# EAGLE design Adafruit PyPortal Titano (EAGLE 9.5.1)

## Sheet 1 of 3
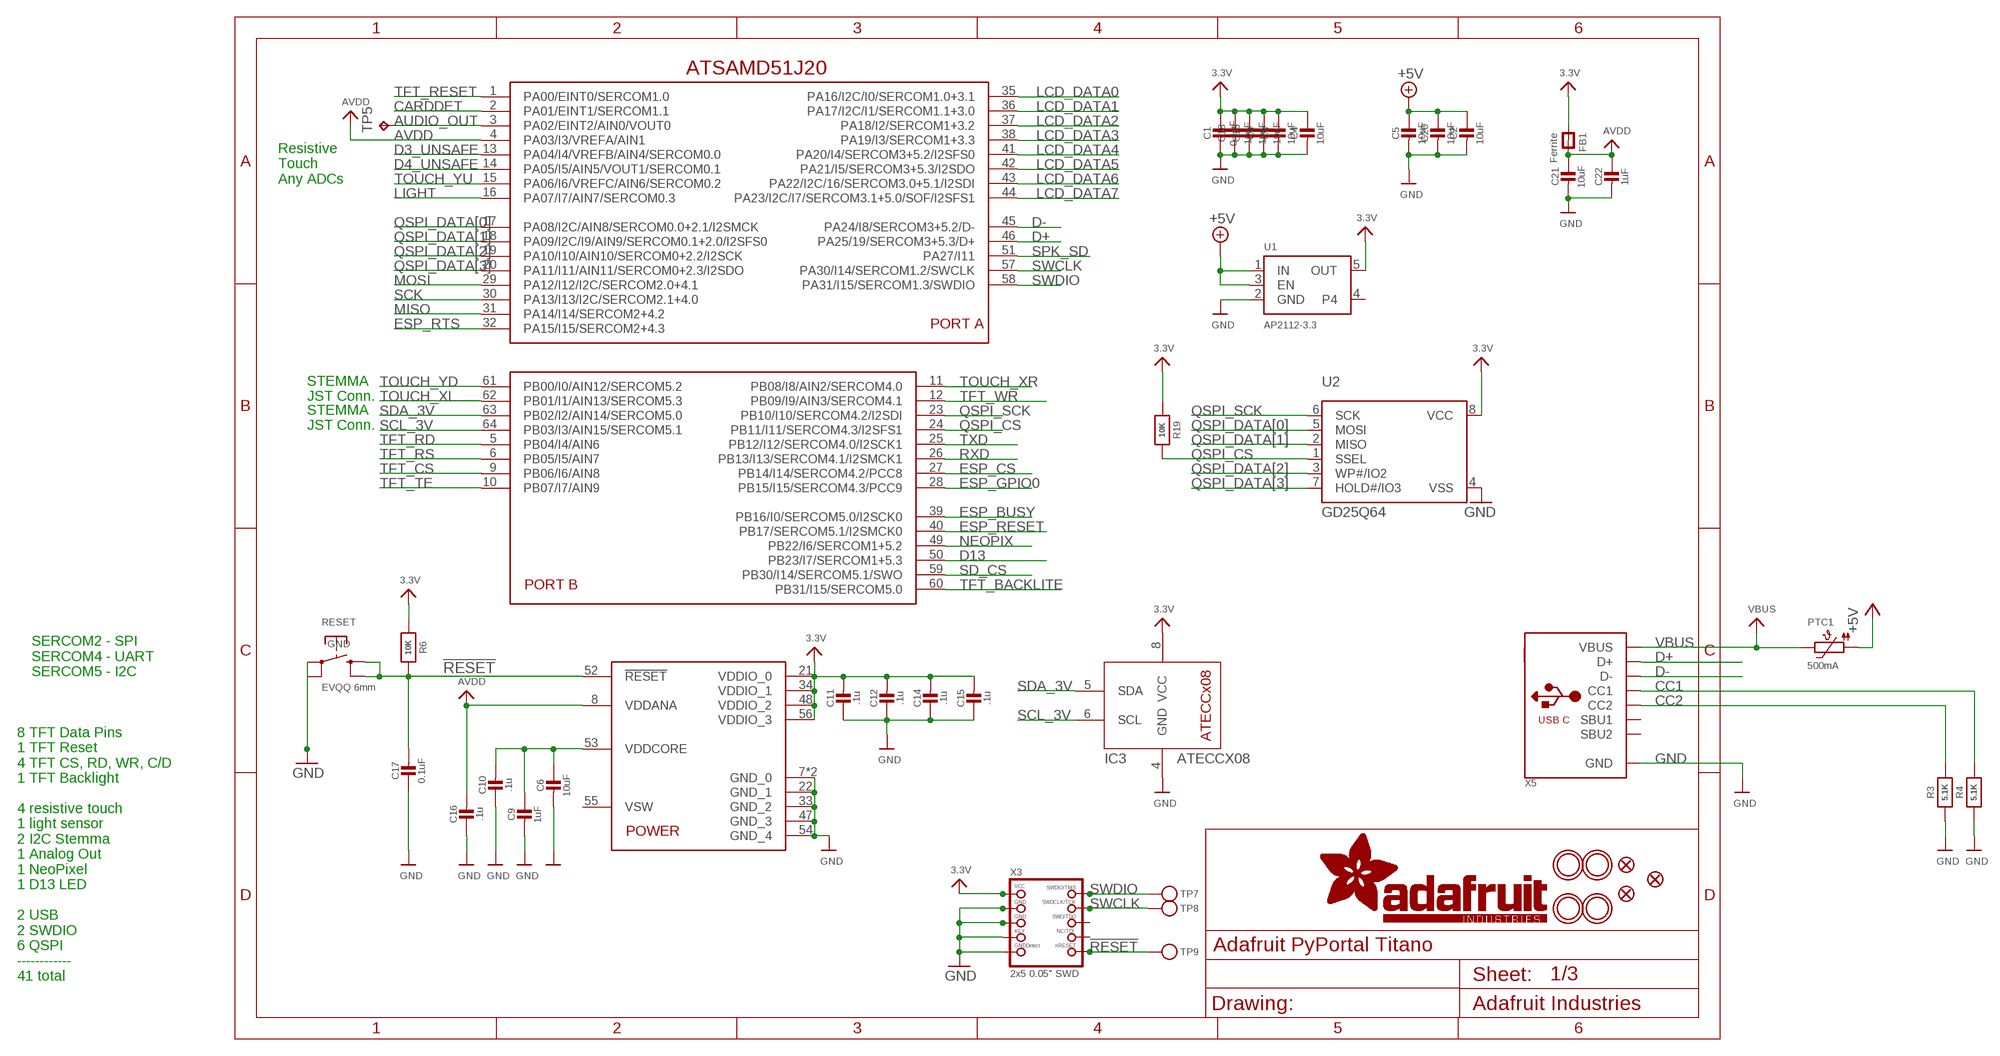
[diagram p0: schematic, sheet 1]

### Parts
C1  0.1uF  CAP_CERAMIC0603_NO  [0603-NO]
C2  10uF  CAP_CERAMIC0805-NOOUTLINE  [0805-NO]
C3  10uF  CAP_CERAMIC0805-NOOUTLINE  [0805-NO]
C4  10uF  CAP_CERAMIC0805-NOOUTLINE  [0805-NO]
C5  10uF  CAP_CERAMIC0805-NOOUTLINE  [0805-NO]
C6  10uF  CAP_CERAMIC0805-NOOUTLINE  [0805-NO]
C8  10uF  CAP_CERAMIC0805-NOOUTLINE  [0805-NO]
C9  1uF  CAP_CERAMIC0603_NO  [0603-NO]
C10  .1u  CAP_CERAMIC0603_NO  [0603-NO]
C11  .1u  CAP_CERAMIC0603_NO  [0603-NO]
C12  .1u  CAP_CERAMIC0603_NO  [0603-NO]
C13  10uF  CAP_CERAMIC0805-NOOUTLINE  [0805-NO]
C14  .1u  CAP_CERAMIC0603_NO  [0603-NO]
C15  .1u  CAP_CERAMIC0603_NO  [0603-NO]
C16  .1u  CAP_CERAMIC0603_NO  [0603-NO]
C17  0.1uF  CAP_CERAMIC0603_NO  [0603-NO]
C18  10uF  CAP_CERAMIC0805-NOOUTLINE  [0805-NO]
C20  10uF  CAP_CERAMIC0805-NOOUTLINE  [0805-NO]
C21  10uF  CAP_CERAMIC0805-NOOUTLINE  [0805-NO]
C22  1uF  CAP_CERAMIC0603_NO  [0603-NO]
FB1  Ferrite  FERRITE-0805NO  [0805-NO]
IC3  ATECCX08  [SOIC8_150MIL]
PTC1  500mA  PTC1206  [1206]
R3  5.1K  RESISTOR_0603_NOOUT  [0603-NO]
R4  5.1K  RESISTOR_0603_NOOUT  [0603-NO]
R6  10K  RESISTOR_0603_NOOUT  [0603-NO]
R19  10K  RESISTOR_0603_NOOUT  [0603-NO]
RESET  EVQQ 6mm  SWITCH_TACT_SMT_EVQQ2_SMALL  [EVQ-Q2_SMALLER]
TP5  TPTP15R  [TP15R]
TP7  TESTPOINTROUND1.5MM  [TESTPOINT_ROUND_1.5MM]
TP8  TESTPOINTROUND1.5MM  [TESTPOINT_ROUND_1.5MM]
TP9  TESTPOINTROUND1.5MM  [TESTPOINT_ROUND_1.5MM]
U1  AP2112-3.3  VREG_SOT23-5  [SOT23-5]
U2  GD25Q64  SPIFLASH_8PIN208MIL  [SOIC8_208MIL]
U$2  ATSAMD51J20  ATSAMD51J  [PQFN64-1]
U$7  MOUNTINGHOLE3.0THIN  [MOUNTINGHOLE_3.0_PLATEDTHIN]
U$9  FIDUCIAL_1MM  [FIDUCIAL_1MM]
U$11  FIDUCIAL_1MM  [FIDUCIAL_1MM]
U$15  MOUNTINGHOLE3.0THIN  [MOUNTINGHOLE_3.0_PLATEDTHIN]
U$16  MOUNTINGHOLE3.0THIN  [MOUNTINGHOLE_3.0_PLATEDTHIN]
U$17  MOUNTINGHOLE3.0THIN  [MOUNTINGHOLE_3.0_PLATEDTHIN]
U$23  FIDUCIAL_1MM  [FIDUCIAL_1MM]
X3  2x5 0.05" SWD  JTAG-CORTEXBOXPOSTS  [2X05_1.27MM_BOX_POSTS]
X5  USB_C  [USB_C_CUSB31-CFM2AX-01-X]

### Nets
3.3V [power]: C1.1 C3.1 C4.1 C8.1 C11.2 C12.2 C13.1 C14.2 C15.2 C18.1 FB1.1 IC3.8(VCC) R6.1 R19.1 U1.5(OUT) U2.8(VCC) U$2.21(VDDIO_0) U$2.34(VDDIO_1) U$2.48(VDDIO_2) U$2.56(VDDIO_3) X3.1(VCC) ; also sheet 2,3
!RESET: C17.2 R6.2 RESET.B'(S1) RESET.B(S) TP9.P$1 U$2.52(!RESET) X3.10(NRESET)
+5V [power]: C2.1 C5.1 C20.1 PTC1.1 U1.1(IN) U1.3(EN) ; also sheet 2,3
AUDIO_OUT: TP5.TP U$2.3(PA02/EINT2/AIN0/VOUT0) ; also sheet 3
AVDD [power]: C16.2 C21.1 C22.1 FB1.2 U$2.4(PA03/I3/VREFA/AIN1) U$2.8(VDDANA)
CARDDET: U$2.2(PA01/EINT1/SERCOM1.1) ; also sheet 2
CC1: R4.2 X5.A5(CC1)
CC2: R3.2 X5.B5(CC2)
D3_UNSAFE: U$2.13(PA04/I4/VREFB/AIN4/SERCOM0.0) ; also sheet 3
D4_UNSAFE: U$2.14(PA05/I5/AIN5/VOUT1/SERCOM0.1) ; also sheet 3
D13: U$2.50(PB23/I7/SERCOM1+5.3) ; also sheet 3
D+: U$2.46(PA25/19/SERCOM3+5.3/D+) X5.A6(D+) X5.B6(D+)
D-: U$2.45(PA24/I8/SERCOM3+5.2/D-) X5.A7(D-) X5.B7(D-)
ESP_BUSY: U$2.39(PB16/I0/SERCOM5.0/I2SCK0) ; also sheet 2
ESP_CS: U$2.27(PB14/I14/SERCOM4.2/PCC8) ; also sheet 2
ESP_GPIO0: U$2.28(PB15/I15/SERCOM4.3/PCC9) ; also sheet 2
ESP_RESET: U$2.40(PB17/SERCOM5.1/I2SMCK0) ; also sheet 2
ESP_RTS: U$2.32(PA15/I15/SERCOM2+4.3) ; also sheet 2
GND: C1.2 C2.2 C3.2 C4.2 C5.2 C6.2 C8.2 C9.2 C10.1 C11.1 C12.1 C13.2 C14.1 C15.1 C16.1 C17.1 C18.2 C20.2 C21.2 C22.2 IC3.4(GND) R3.1 R4.1 RESET.A'(P1) RESET.A(P) U1.2(GND) U2.4(VSS) U$2.7(GND_0) U$2.22(GND_1) U$2.33(GND_2) U$2.47(GND_3) U$2.54(GND_4) U$2.EXP(GND_0) X3.3(GND) X3.5(GND) X3.7(KEY) X3.9(GNDDETECT) X5.A1B12(GND) X5.B1A12(GND) ; also sheet 2,3
LCD_DATA0: U$2.35(PA16/I2C/I0/SERCOM1.0+3.1) ; also sheet 2
LCD_DATA1: U$2.36(PA17/I2C/I1/SERCOM1.1+3.0) ; also sheet 2
LCD_DATA2: U$2.37(PA18/I2/SERCOM1+3.2) ; also sheet 2
LCD_DATA3: U$2.38(PA19/I3/SERCOM1+3.3) ; also sheet 2
LCD_DATA4: U$2.41(PA20/I4/SERCOM3+5.2/I2SFS0) ; also sheet 2
LCD_DATA5: U$2.42(PA21/I5/SERCOM3+5.3/I2SDO) ; also sheet 2
LCD_DATA6: U$2.43(PA22/I2C/16/SERCOM3.0+5.1/I2SDI) ; also sheet 2
LCD_DATA7: U$2.44(PA23/I2C/I7/SERCOM3.1+5.0/SOF/I2SFS1) ; also sheet 2
LIGHT: U$2.16(PA07/I7/AIN7/SERCOM0.3) ; also sheet 3
MISO: U$2.31(PA14/I14/SERCOM2+4.2) ; also sheet 2
MOSI: U$2.29(PA12/I12/I2C/SERCOM2.0+4.1) ; also sheet 2
NEOPIX: U$2.49(PB22/I6/SERCOM1+5.2) ; also sheet 3
QSPI_CS: R19.2 U2.1(SSEL) U$2.24(PB11/I11/SERCOM4.3/I2SFS1)
QSPI_DATA[0]: U2.5(MOSI) U$2.17(PA08/I2C/AIN8/SERCOM0.0+2.1/I2SMCK)
QSPI_DATA[1]: U2.2(MISO) U$2.18(PA09/I2C/I9/AIN9/SERCOM0.1+2.0/I2SFS0)
QSPI_DATA[2]: U2.3(WP#/IO2) U$2.19(PA10/I10/AIN10/SERCOM0+2.2/I2SCK)
QSPI_DATA[3]: U2.7(HOLD#/IO3) U$2.20(PA11/I11/AIN11/SERCOM0+2.3/I2SDO)
QSPI_SCK: U2.6(SCK) U$2.23(PB10/I10/SERCOM4.2/I2SDI)
RXD: U$2.26(PB13/I13/SERCOM4.1/I2SMCK1) ; also sheet 2
SCK: U$2.30(PA13/I13/I2C/SERCOM2.1+4.0) ; also sheet 2
SCL_3V: IC3.6(SCL) U$2.64(PB03/I3/AIN15/SERCOM5.1) ; also sheet 3
SD_CS: U$2.59(PB30/I14/SERCOM5.1/SWO) ; also sheet 2
SDA_3V: IC3.5(SDA) U$2.63(PB02/I2/AIN14/SERCOM5.0) ; also sheet 3
SPK_SD: U$2.51(PA27/I11) ; also sheet 3
SWCLK: TP8.P$1 U$2.57(PA30/I14/SERCOM1.2/SWCLK) X3.4(SWDCLK)
SWDIO: TP7.P$1 U$2.58(PA31/I15/SERCOM1.3/SWDIO) X3.2(SWDIO)
TFT_BACKLITE: U$2.60(PB31/I15/SERCOM5.0) ; also sheet 2
TFT_CS: U$2.9(PB06/I6/AIN8) ; also sheet 2
TFT_RD: U$2.5(PB04/I4/AIN6) ; also sheet 2
TFT_RESET: U$2.1(PA00/EINT0/SERCOM1.0) ; also sheet 2
TFT_RS: U$2.6(PB05/I5/AIN7) ; also sheet 2
TFT_TE: U$2.10(PB07/I7/AIN9) ; also sheet 2
TFT_WR: U$2.12(PB09/I9/AIN3/SERCOM4.1) ; also sheet 2
TOUCH_XL: U$2.62(PB01/I1/AIN13/SERCOM5.3) ; also sheet 2
TOUCH_XR: U$2.11(PB08/I8/AIN2/SERCOM4.0) ; also sheet 2
TOUCH_YD: U$2.61(PB00/I0/AIN12/SERCOM5.2) ; also sheet 2
TOUCH_YU: U$2.15(PA06/I6/VREFC/AIN6/SERCOM0.2) ; also sheet 2
TXD: U$2.25(PB12/I12/SERCOM4.0/I2SCK1) ; also sheet 2
VBUS [power]: PTC1.2 X5.A4B9(VBUS) X5.B4A9(VBUS)
VDDCORE: C6.1 C9.1 C10.2 U$2.53(VDDCORE)
Unconnected: U1.4 U$2.55(VSW) X3.6(SWO) X3.8(TDI) X5.A8(SBU1) X5.B8(SBU2)

### Notes on the sheet
- ATSAMD51J20
- Resistive
  Touch
  Any ADCs
- STEMMA
  JST Conn.
- STEMMA
  JST Conn.
- SERCOM2 - SPI
  SERCOM4 - UART
  SERCOM5 - I2C
- 8 TFT Data Pins ✓
  1 TFT Reset
  4 TFT CS, RD, WR, C/D
  1 TFT Backlight
  
  4 resistive touch ✓
  1 light sensor ✓
  2 I2C Stemma ✓
  1 Analog Out
  1 NeoPixel
  1 D13 LED ✓
  
  2 USB ✓
  2 SWDIO ✓
  6 QSPI ✓
  ------------
  41 total

## Sheet 2 of 3
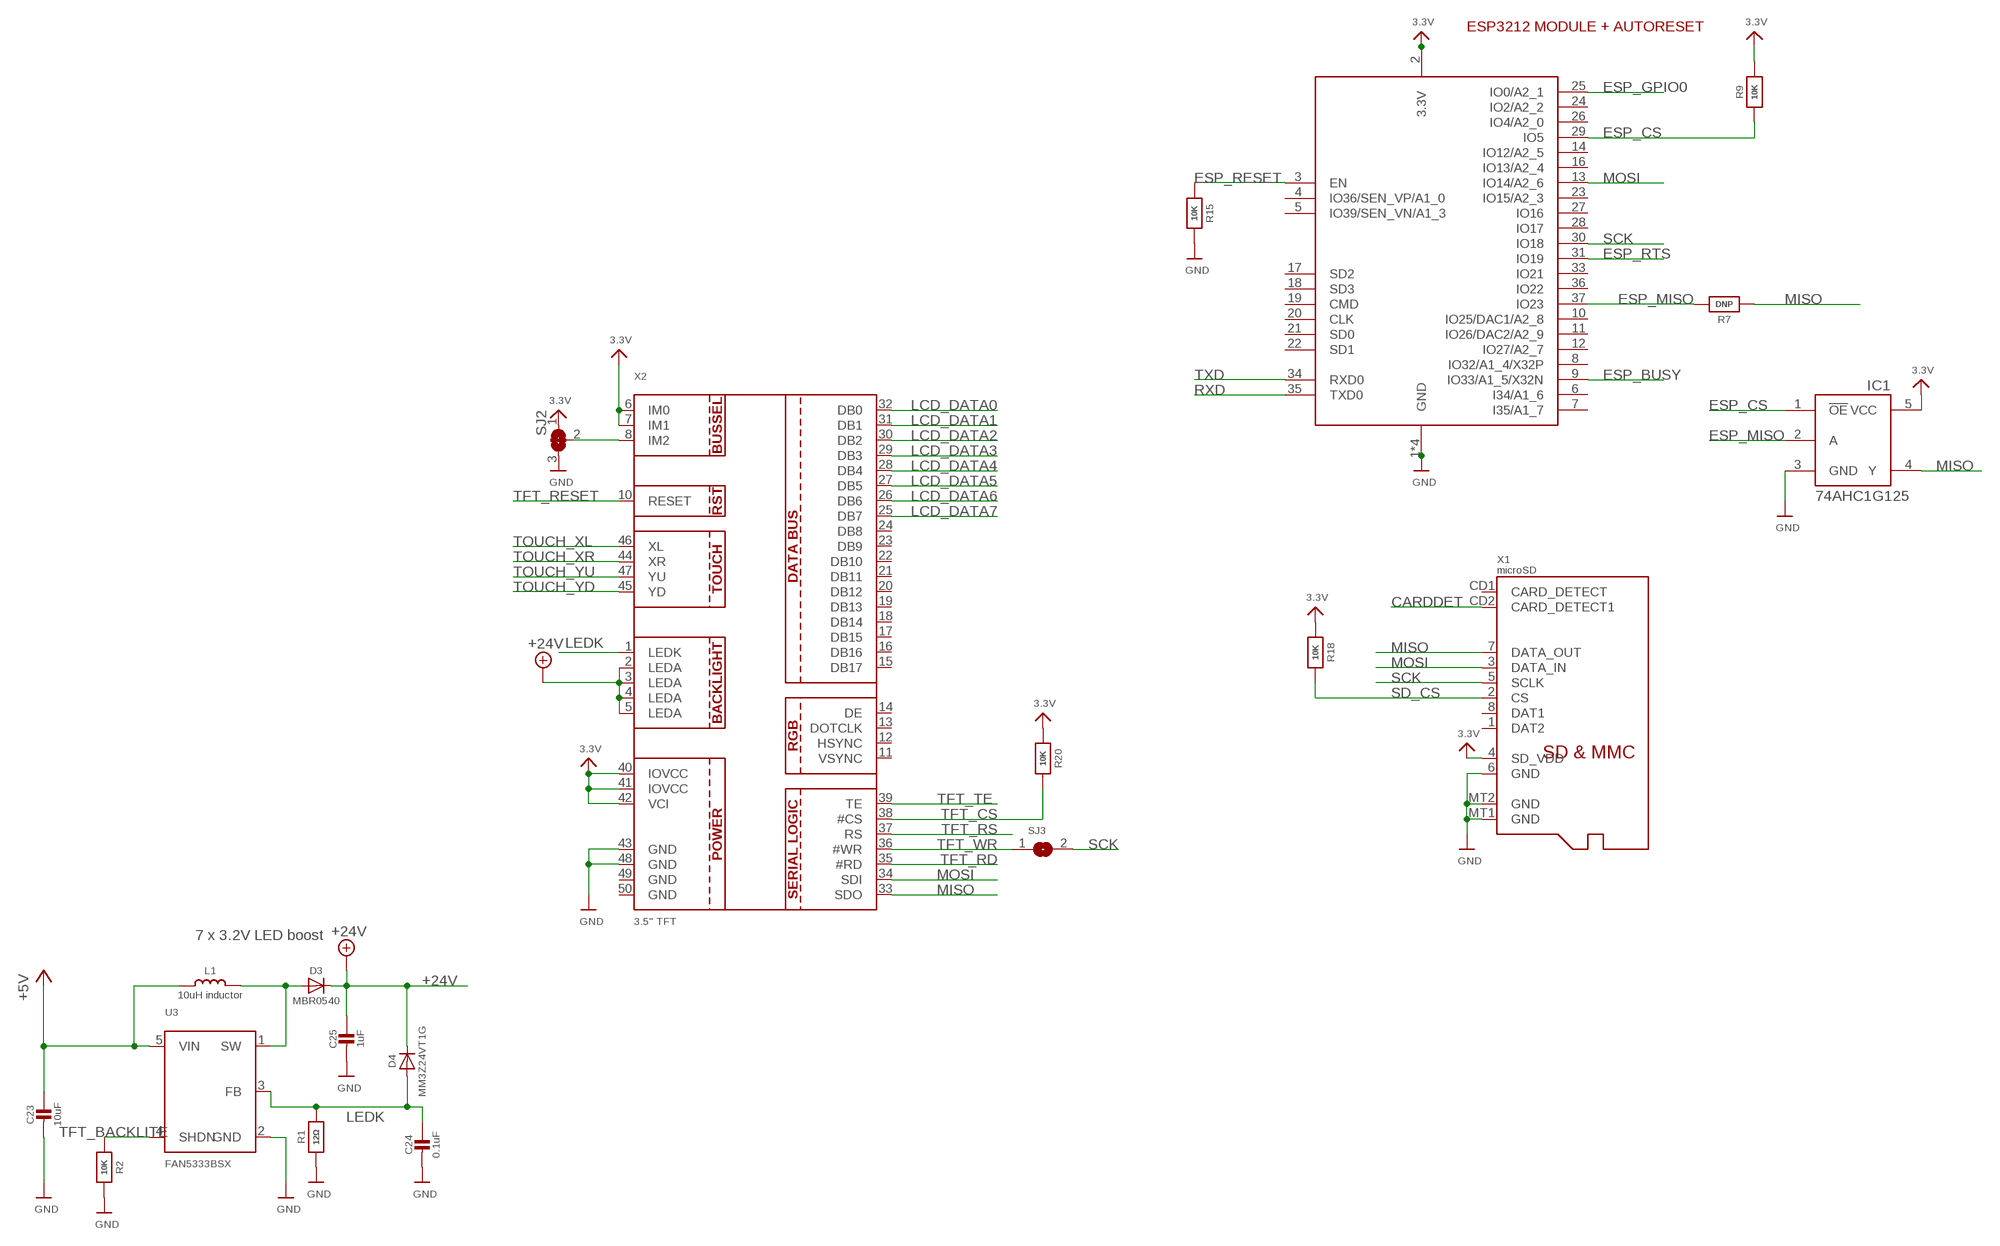
[diagram p1: schematic, sheet 2]

### Parts
C23  10uF  CAP_CERAMIC0805-NOOUTLINE  [0805-NO]
C24  0.1uF  CAP_CERAMIC0805-NOOUTLINE  [0805-NO]
C25  1uF  CAP_CERAMIC0805-NOOUTLINE  [0805-NO]
D3  MBR0540  DIODESOD-123  [SOD-123]
D4  MM3Z24VT1G  DIODESMA  [SMADIODE]
IC1  74AHC1G125  [SOT23-5L]
L1  10uH inductor  INDUCTORNR5040  [INDUCTOR_5X5MM_NR5040_NOTHERMALS]
R1  12Ω  RESISTOR0805_NOOUTLINE  [0805-NO]
R2  10K  RESISTOR_0603_NOOUT  [0603-NO]
R7  DNP  RESISTOR_0603_NOOUT  [0603-NO]
R9  10K  RESISTOR_0603_NOOUT  [0603-NO]
R15  10K  RESISTOR_0603_NOOUT  [0603-NO]
R18  10K  RESISTOR_0603_NOOUT  [0603-NO]
R20  10K  RESISTOR_0603_NOOUT  [0603-NO]
SJ2  SOLDERJUMPER_2WAY  [SOLDERJUMPER_2WAY_OPEN_NOPASTE]
SJ3  SOLDERJUMPER  [SOLDERJUMPER_ARROW_NOPASTE]
U3  FAN5333BSX  VREG_FAN5331  [SOT23-5]
X1  microSD  MICROSD  [MICROSD]
X2  3.5" TFT  DISP_LCD_3.5IN_320X480_50PIN  [TFT_3.5IN_320X480_50PIN]
X6  ESP32_WROOM32  [WROOM32]

### Nets
3.3V [power]: IC1.5(VCC) R9.2 R18.1 R20.1 SJ2.1 X1.4(SD_VDD) X2.6(IM0) X2.7(IM1) X2.40(IOVCC) X2.41(IOVCC) X2.42(VCI) X6.2(3.3V) ; also sheet 1,3
+5V [power]: C23.1 L1.P$1 U3.5(VIN) ; also sheet 1,3
+24V: C25.1 D3.C D4.C X2.2(LEDA) X2.3(LEDA) X2.4(LEDA) X2.5(LEDA)
CARDDET: X1.CD2(CARD_DETECT1) ; also sheet 1
ESP_BUSY: X6.9(IO33/A1_5/X32N) ; also sheet 1
ESP_CS: IC1.1(!OE) R9.1 X6.29(IO5) ; also sheet 1
ESP_GPIO0: X6.25(IO0/A2_1) ; also sheet 1
ESP_MISO: IC1.2(A) R7.2 X6.37(IO23)
ESP_RESET: R15.1 X6.3(EN) ; also sheet 1
ESP_RTS: X6.31(IO19) ; also sheet 1
GND: C23.2 C24.2 C25.2 IC1.3(GND) R1.1 R2.2 R15.2 SJ2.3 U3.2(GND) X1.6(GND) X1.MT1(GND) X1.MT2(GND) X2.43(GND) X2.48(GND) X6.1(GND) X6.15(GND) X6.38(GND) X6.P$1(GND) ; also sheet 1,3
LCD_DATA0: X2.32(DB0) ; also sheet 1
LCD_DATA1: X2.31(DB1) ; also sheet 1
LCD_DATA2: X2.30(DB2) ; also sheet 1
LCD_DATA3: X2.29(DB3) ; also sheet 1
LCD_DATA4: X2.28(DB4) ; also sheet 1
LCD_DATA5: X2.27(DB5) ; also sheet 1
LCD_DATA6: X2.26(DB6) ; also sheet 1
LCD_DATA7: X2.25(DB7) ; also sheet 1
LEDK: C24.1 D4.A R1.2 U3.3(FB) X2.1(LEDK)
MISO: IC1.4(Y) R7.1 X1.7(DATA_OUT) X2.33(SDO) ; also sheet 1
MOSI: X1.3(DATA_IN) X2.34(SDI) X6.13(IO14/A2_6) ; also sheet 1
N$5: SJ2.2 X2.8(IM2)
N$6: D3.A L1.P$2 U3.1(SW)
RXD: X6.35(TXD0) ; also sheet 1
SCK: SJ3.2 X1.5(SCLK) X6.30(IO18) ; also sheet 1
SD_CS: R18.2 X1.2(CS) ; also sheet 1
TFT_BACKLITE: R2.1 U3.4(SHDN) ; also sheet 1
TFT_CS: R20.2 X2.38(#CS) ; also sheet 1
TFT_RD: X2.35(#RD) ; also sheet 1
TFT_RESET: X2.10(RESET) ; also sheet 1
TFT_RS: X2.37(RS) ; also sheet 1
TFT_TE: X2.39(TE) ; also sheet 1
TFT_WR: SJ3.1 X2.36(#WR) ; also sheet 1
TOUCH_XL: X2.46(XL) ; also sheet 1
TOUCH_XR: X2.44(XR) ; also sheet 1
TOUCH_YD: X2.45(YD) ; also sheet 1
TOUCH_YU: X2.47(YU) ; also sheet 1
TXD: X6.34(RXD0) ; also sheet 1
Unconnected: X1.1(DAT2) X1.8(DAT1) X1.CD1(CARD_DETECT) X2.11(VSYNC) X2.12(HSYNC) X2.13(DOTCLK) X2.14(DE) X2.15(DB17) X2.16(DB16) X2.17(DB15) X2.18(DB14) X2.19(DB13) X2.20(DB12) X2.21(DB11) X2.22(DB10) X2.23(DB9) X2.24(DB8) X2.49(GND) X2.50(GND) X6.4(IO36/SEN_VP/A1_0) X6.5(IO39/SEN_VN/A1_3) X6.6(I34/A1_6) X6.7(I35/A1_7) X6.8(IO32/A1_4/X32P) X6.10(IO25/DAC1/A2_8) X6.11(IO26/DAC2/A2_9) X6.12(IO27/A2_7) X6.14(IO12/A2_5) X6.16(IO13/A2_4) X6.17(SD2) X6.18(SD3) X6.19(CMD) X6.20(CLK) X6.21(SD0) X6.22(SD1) X6.23(IO15/A2_3) X6.24(IO2/A2_2) X6.26(IO4/A2_0) X6.27(IO16) X6.28(IO17) X6.33(IO21) X6.36(IO22)

### Notes on the sheet
- ESP3212 MODULE + AUTORESET
- 7 x 3.2V LED boost

## Sheet 3 of 3
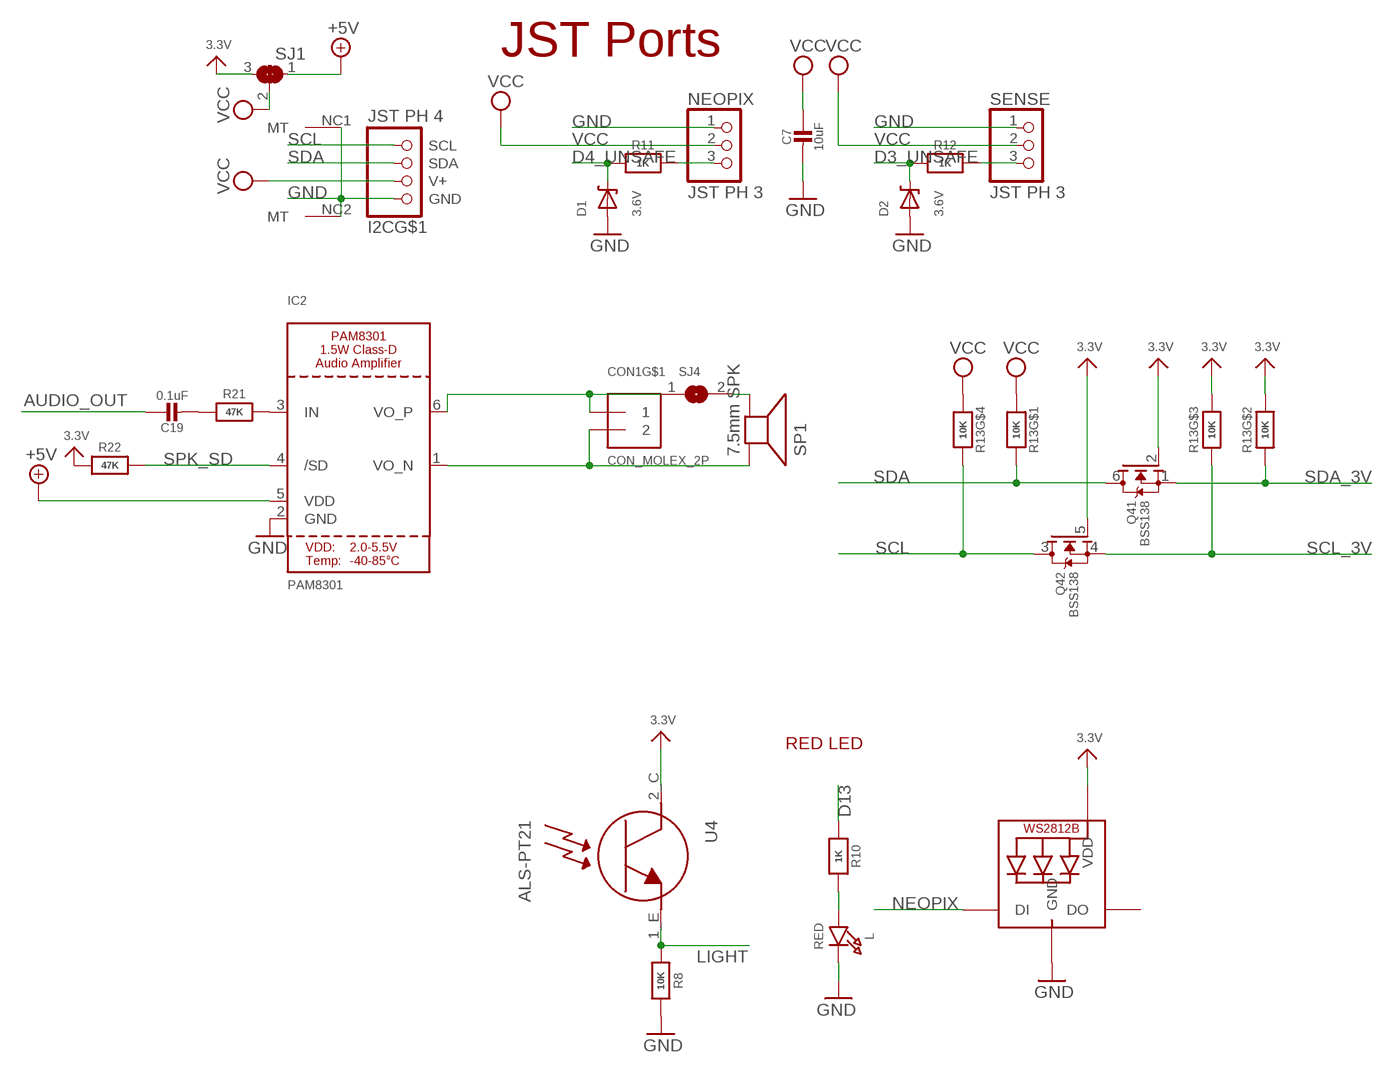
[diagram p2: schematic, sheet 3]

### Parts
C7  10uF  CAP_CERAMIC0805-NOOUTLINE  [0805-NO]
C19  0.1uF  CAP_CERAMIC0603_NO  [0603-NO]
CON1  CON_MOLEX_2P  [53398-0271]
D1  3.6V  DIODE-ZENERSOD323  [SOD-323]
D2  3.6V  DIODE-ZENERSOD323  [SOD-323]
I2C  JST PH 4  STEMMA_I2C_RASMT  [JSTPH4]
IC2  PAM8301  [SOT23-6]
L  RED  LED0805_NOOUTLINE  [CHIPLED_0805_NOOUTLINE]
LED1  WS2812B3535  [LED3535]
NEOPIX  JST PH 3  CON_JST_PH_3PIN  [JSTPH3]
Q4  BSS138  MOSFET-N_DUAL  [SOT363]
R8  10K  RESISTOR_0603_NOOUT  [0603-NO]
R10  1K  RESISTOR_0603_NOOUT  [0603-NO]
R11  1K  RESISTOR_0603_NOOUT  [0603-NO]
R12  1K  RESISTOR_0603_NOOUT  [0603-NO]
R13  10K  RESISTOR_4PACK  [RESPACK_4X0603]
R21  47K  RESISTOR_0603_NOOUT  [0603-NO]
R22  47K  RESISTOR_0603_NOOUT  [0603-NO]
SENSE  JST PH 3  CON_JST_PH_3PIN  [JSTPH3]
SJ1  SOLDERJUMPER_2WAY  [SOLDERJUMPER_2WAY_OPEN_NOPASTE]
SJ4  SOLDERJUMPERCLOSED  [SOLDERJUMPER_CLOSEDWIRE]
SP1  7.5mm SPK  SPEAKER_7.5MM  [BUZZER_SMT_7.5MM]
U4  ALS-PT21  PHOTOTRANSISTOR_PT26-21C  [ALS-PT26-21C]

### Nets
3.3V [power]: LED1.2(VDD) Q4.2(1:G) Q4.5(2:G) R13.2 R13.3 R22.1 SJ1.3 U4.2_C(C) ; also sheet 1,2
+5V [power]: IC2.5(VDD) SJ1.1 ; also sheet 1,2
AUDIO_OUT: C19.1 ; also sheet 1
D3: R12.1 SENSE.3
D3_UNSAFE: D2.C R12.2 ; also sheet 1
D4: NEOPIX.3 R11.1
D4_UNSAFE: D1.C R11.2 ; also sheet 1
D13: R10.1 ; also sheet 1
GND: C7.2 D1.A D2.A I2C.1(GND) I2C.NC1(MT) I2C.NC2(MT) IC2.2(GND) L.C LED1.4(GND) NEOPIX.1 R8.1 SENSE.1 ; also sheet 1,2
LIGHT: R8.2 U4.1_E(E) ; also sheet 1
N$8: L.A R10.2
N$10: C19.2 R21.1
N$11: IC2.3(IN) R21.2
N$13: SJ4.2 SP1.-
NEOPIX: LED1.1(DI) ; also sheet 1
SCL: I2C.4(SCL) Q4.3(2:D) R13.5
SCL_3V: Q4.4(2:S) R13.6 ; also sheet 1
SDA: I2C.3(SDA) Q4.6(1:D) R13.8
SDA_3V: Q4.1(1:S) R13.7 ; also sheet 1
SPK_SD: IC2.4(/SD) R22.2 ; also sheet 1
SPKR+: CON1.2 IC2.1(VO_N) SP1.+
SPRK-: CON1.1 IC2.6(VO_P) SJ4.1
VCC: C7.1 I2C.2(V+) NEOPIX.2 R13.1 R13.4 SENSE.2 SJ1.2
Unconnected: CON1.M1(MT) CON1.M2(MT) LED1.3(DO)

### Notes on the sheet
- JST Ports
- RED LED

## Library data of the parts
C1-C25 = microbuilder:CAP_CERAMIC: Ceramic Capacitors For new designs, use the packages preceded by an '_' character since they are more reliable: The following footprints should be used on most boards: _0402 - Standard footprint for regular board layouts _0603 - Standard footprint for regular board layouts _0805 - Standard footprint for regular board layouts _1206 - Standard footprint for regular board layouts For extremely tight-pitch boards where space is at a premium, the following 'micro-pitch' footprints can be used (smaller pads, no silkscreen outline, etc.): _0402MP - Micro-pitch footprint for very dense/compact boards _0603MP - Micro-pitch footprint for very dense/compact boards _0805MP - Micro-pitch footprint for very dense/compact boards _1206MP - Micro-pitch footprint for very dense/compact boards
CON1 = microbuilder:CON_MOLEX_2P
D1 D2 = microbuilder:DIODE-ZENER: Zener Diode SMA: 30V 1W Zener Diode, 1.2Vf - Digikey: SMAZ30-FDICT-ND
D3 D4 = microbuilder:DIODE: Diode SMA Model Volts Amps Type Vf Ir Digikey # Notes SSA34-E3 40V 3A Schottky 480mV @ 3A 200uA @ 40V SSA34-E3/61TGITR-ND CDBA120-G 20V 1A Schottky 500mV @ 1A 500uA @ 20V 641-1014-6-ND REEL MBRA210 10V 2A Schottky 350mV @ 2A 700uA @ 10V MBRA210LT3 SOD-123 Model Volts Amps Type Vf Ir Order # Notes BAT54T1G 30V 200mA Schottky 800mV @ 200mA 2uA @ 25V BAT54T1GOSTR-ND B0530W 30V 500mA Schottky 430mV @ 500mA 130uA @ 30V B0530W-FDICT-ND REEL MBR120 20V 1A Schottky 340mV @ 1A MBR120VLSFT1GOSCT-ND SOD-323 Model Volts Amps Type Vf Ir Order # Notes PMEG2005EJ 20V 500mA Schottky 355mV @ 500mA 568-4110-1-ND ZLLS410 10V 570mA Schottky 380mV @ 570mA ZLLS410CT-ND 1N4148WS 75V 150mA Silicon/Simple 1V 1N4148WSFSCT-ND REEL SOD-523 Model Volts Amps Type Vf Ir Order # Notes BAT54XV2 30V 200mA Schottky 0.8V @ 100mA BAT54XV2CT-ND TB751S 30V 30mA Schottky RB751S-40TE61CT-ND SOT23-R/W (R = Solder Paste/Reflow Ovens, W = Hand-Soldering) Model Volts Amps Type Vf Ir Order # Notes BAT54FILM 40V 300mA Schottky 497-7162-1-ND POWERDI-5 Model Volts Amps Type Vf Ir Order # Notes PDS560 60V 5A Schottky 670mV @ 5A 150uA @ 60V PDS560DICT-ND
FB1 = microbuilder:FERRITE: Ferrite Bead 0603 MMZ1608B121C - 120 Ohm @ 100MHz, 600mA, 0.15 Ohm DC Resistance - Digikey: 445-2164-1-ND BK1608HW121-T - 120 Ohm, 600mA Ferrite Chip - Digikey: 587-1876-2-ND 0805 HZ0805B272R-10 - 2.7K Ohm @ 100MHz, 200mA, 0.8 Ohm DC Resistance - Digikey: 240-2504-1-ND (see also Murata BLM21BD272SN1L) MMZ2012Y152B - 1.5K Ohm @ 100MHz, 500mA, 0.4 Ohm DC Resistance - Digikey: 445-1560-1-ND - Mainly for high frequency (80-400MHz) MMZ2012R102A - 1K Ohm @ 100MHz, 500mA, 0.3 Ohm DC Resistance - Digikey: 445-1555-2-ND - More general purpose (10-200MHz)
I2C = microbuilder:STEMMA_I2C
IC1 = adafruit:74AHC1G125
IC2 = microbuilder:PAM8301
IC3 = microbuilder:ATECCX08
L = microbuilder:LED: LED 0603 - 0603 Surface Mount Package 2mA: Green LED - Low Power (3.9mcd, 2ma, 1.7Vf) - Digikey: 475-2709-2-ND Orange LED - Low Power (9.8mcd, 2ma, 1.8Vf) - Digikey: 475-1194-2-ND Red LED - Low Power (5mcd, 2ma, 1.8Vf) - Digikey: 475-1195-2-ND Yellow LED - Low Power (7mcd, 2ma, 1.8Vf) - Digikey: 475-1196-2-ND 5mA: Blue LED - Low Power (17mcd, 5ma, 2.9Vf) - Digikey: LNJ937W8CRACT-ND 0805 - 0805 Surface Mount Package 2mA: Red LED (8.8mcd, 2mA, 1.8Vf, Clear) - Low Power [Digikey: 475-2510-1-ND] Green LED (5mcd, 2mA, 1.8Vf, Clear) - Low Power [Digikey: 475-2730-1-ND] Yellow LED (11.3mcd, 2mA, 1.8Vf, Clear) - Low Power [Digikey: 475-2555-1-ND] 20mA: Red LED (104mcd, 20mA, Diffused) - LS R976 [Digikey: 475-1278-6-ND] Red LED (12mcd, 20mA, 2.0Vf, Clear) - APT2012EC [Digikey: 754-1128-1-ND] Green LED (15mcd, 20mA, 2.2Vf, Clear) - APT2012GC [Digikey: 754-1131-1-ND] Orange LED (160mcd, 20mA, 2.1Vf, Clear) - APT2012SECK [Digikey: 754-1130-1-ND] 1206 - 1206 Surface Mount Package Green LED (26mcd, 20mA, Diffused) - LG N971 [Digikey: 475-1407-6-ND] Red LED (15mcd, 20mA, Diffused) - LH N974 [Digikey: 475-1416-6-ND] Cree - Cree High-Power Surface Mount LEDs XPEBWT-L1-0000-00D50 - White 111lm 350mA 2.9Vf 6200K 110° XTEAWT-00-0000-00000LEE3 - White 114lm 350mA 2.85Vf 5000K 115° Everlight - Everlight 45-21 Series Surface Mount LEDs 45-21/QK2C-B2832AC2CB2/2T - Warm White 2000mcd 20mA 3.25Vf 3050K 120° 45-21/LK2C-B38452C4CB2/2T - Nuetral White 2000mcd 20mA 3.25Vf 4150K 120° 45-21/LK2C-B50634C6CB2/2T - Cold White 2200mcd 20mA 3.25Vf 5650K 120° PLCC2 Reverse Mount LS T77K-J1L2-1-0-2-R18-Z - Red 11.25mcd 2mA 1.8Vf 630nm 120° LO T77K-L1M2-24-Z - Orange 19.6mcd 2mA 1.8Vf 606nm 120° LY T77K-K2M1-26-Z - Yellow 15.7mcd 2mA 1.8Vf 587nm 120°
L1 = microbuilder:INDUCTOR: Inductors 0603: 10nH Ceramic Inductor - microwire antenna/RF (Digikey: 712-1434-2-ND) 0805: 560nH Ceramic Inductor - RF (Digikey: 553-1047-1-ND) 270nH Ceramic Inductor - Q = 40@250MHz, +-5%, 1 Ohm DC Resistance (Digikey: 535-10506-2-ND) 1007 (2518 Metric) SMT: 10µH 10% 250mOhm 820mA 1007 Inductor (Digikey: 587-2189-1-ND) 22µH 10% 500mOhm 580mA 1007 Inductor (Digikey: 587-2190-1-ND) 47µH 10% 950mOhm 420mA 1007 Inductor (Digikey: 587-2191-1-ND) 47µH 5% 100mOhm 1A 1008 Inductor (Digikey: 732-1816-1-ND) 5.0x5.0mm (Taiyo Yuden NR5040 Series) 6.8µH 20% 2.3A 64mOhm Inductor (Digikey: 587-2374-2-ND) 5.0x5.0mm (TDK VLC5045 Series) 4.7µH 20% 3.3A 34mOhm Inductor (Digikey: 445-6526-1-ND) 6.8µH 20% 2.7A 46mOhm Inductor (Digikey: 445-6527-1-ND) 6.0x6.0mm (TDK VLC6045 Series) 4.7µH 20% 3.8A 27mOhm Inductor (Digikey: 445-6538-2-ND) 6.8µH 20% 3A 41mOhm Inductor (Digikey: 445-6540-1-ND) 6.2µH 30% 2.2A 45mOhm Inductor (Digikey: SRR5028-6R2YCT-ND) - Not TDK VLC6045 but footprint should match 6.0x6.0mm (TDK SLF6045 Series) 6.8uH 30% 2A 33mOhm Inductor (Digikey: 445-4572-1-ND, Mouser: 810-SLF645T6R8N2R0PF) 6.0x6.0mm (Sumida CDRH5D28 Series) 6.2uH 30% 1.8A 45mOhm Inductor (Digikey: 308-1542-1-ND) Taiyo Yuden NR3015T2R2M - 2.2uH 20% 1.5A (Digikey: 587-1648-2-ND, Mouser: 963-NR3015T2R2M) - Used with TI TPS62172 CoilCraft RFID Transponder Coil - MA5532-AE (For use with AS3935 Lightning Sensor) Taiyo Yuden NRH2412T2R2MNGH - 2.2uH 20% 1AA (Digikey: 587-3443-1-ND) - Used with TI LM3671 Vishay IHLP 1.0uH Molded Inductor - 24mOhm DCR, 5A, +/-20%, -55°C-125°C (Digikey: 541-1319-1-ND)
LED1 = microbuilder:WS2812B
NEOPIX SENSE = microbuilder:CON_JST_PH_3PIN
PTC1 = microbuilder:PTC: PTC (Resettable Fuse) 1206 Package 250mA PTC (16V Max, Time-to-Trip: 0.08s) - Digikey: F2110CT-ND 1210 Package 100mA PTC (30V Max, Time-to-Trip: 0.6s) - Digikey: MF-USMF010-2CT-ND 1812 Package 750mA PTC (24V Max, Time-to-Trip: 0.2s) - Digikey: MF-MSMF075/24-2CT-ND
Q4 = microbuilder:MOSFET-N_DUAL: Dual N-Channel MOSFET SOT363 (2.0x1.25mm) 2N7002PS - 60V, 320mA [Digikey: 568-5984-1-ND]
R1-R4 R6-R12 R15 R18-R22 = microbuilder:RESISTOR: Resistors For new designs, use the packages preceded by an '_' character since they are more reliable: The following footprints should be used on most boards: _0402 - Standard footprint for regular board layouts _0603 - Standard footprint for regular board layouts _0805 - Standard footprint for regular board layouts _1206 - Standard footprint for regular board layouts For extremely tight-pitch boards where space is at a premium, the following 'micro-pitch' footprints can be used (smaller pads, no silkscreen outline, etc.): _0402MP - Micro-pitch footprint for very dense/compact boards _0603MP - Micro-pitch footprint for very dense/compact boards _0805MP - Micro-pitch footprint for very dense/compact boards _1206MP - Micro-pitch footprint for very dense/compact boards
R13 = microbuilder:RESISTOR_4PACK: Resistor Packs (4 resistors) 4 x 0603 10K 1/16W - Digikey: YC164J-10KCT-ND
RESET = microbuilder:SWITCH_TACT_SMT: SMT Tact Switches 6x6mm - Digikey: P12940SCT-ND KMR2 (4.6x2.8mm) - Digikey: 401-1426-1-ND EVQ-PQHB55 - Light Touch, 160GF (4.5x4.5mm) - Digikey: P8090SCT-ND KMT0 - KMT021 NGJ LHS (etc.) IP68/Waterproof - Digikey: CKN10289CT-ND
SJ1 SJ2 = microbuilder:SOLDERJUMPER_2WAY: 2-Way Solder Jumper
SJ3 = microbuilder:SOLDERJUMPER: SMD Solder JUMPER Solder the two pads together to create a connection, or remove the solder to break it. REFLOW - Use this footprint for solder paste and reflow ovens. WAVE - Use this footprint for hand-soldering (larger pads). CLOSED - Has a trace between the two pads to ensure it is closed by default. The trace needs to be cut to disable the jumper, and can be closed again by creating a solder bridge between the two pads.; BOM: EXCLUDE
SJ4 = microbuilder:SOLDERJUMPER: SMD Solder JUMPER Solder the two pads together to create a connection, or remove the solder to break it. REFLOW - Use this footprint for solder paste and reflow ovens. WAVE - Use this footprint for hand-soldering (larger pads). CLOSED - Has a trace between the two pads to ensure it is closed by default. The trace needs to be cut to disable the jumper, and can be closed again by creating a solder bridge between the two pads.
SP1 = microbuilder:SPEAKER: SPEAKER Source: Buerklin Added PS12 (for part # PS1240 piezo) http://www.ladyada.net/library/pcb/eaglelibrary.html
TP5 = testpad:TP: Test pad
TP7-TP9 = microbuilder:TESTPOINT: Test Point Various test points for characterisation and PCB testing TESTPOINT_SMT - Compact Surface Mount Test Point [Digikey: 5016KTR-ND]
U1 = microbuilder:VREG_SOT23-5: SOT23-5 Fixed Voltage Regulators Part Current Out V Out V In V Dropout θJA (°C/W) TJ (°C) Digikey Part No. ADP121 150mA 3.3V 3.4-5.5V 0.09V @ 150mA -- -- ADP121-AUJZ33R7CT-ND ADP121 150mA 3.0V 3.1-5.5V 0.09V @ 150mA -- -- ADP121-AUJZ30R7CT-ND ADP122 300mA 3.3V 3.4-5.5V 0.085V @ 300mA -- -- ADP122AUJZ-3.3-R7CT-ND ADP1712 300mA 3.3V 3.5-5.5V 0.17V @ 300mA -- -- ADP1712AUJZ-3.3-R7TR-ND AP7311 (Low Cost) 150mA 3.3V 3.5-6V 0.15V @ 150mA -- -- AP7311-33WG-7DICT-ND LD39015M18R 150mA 1.8V 1.9V-5.5V 0.08V @ 100mA -- -- 497-6977-1-ND LP2985A-33DBVR 150mA 3.3V 3.3-16V 0.28V @ 150mA 206 150 296-18479-1-ND MCP1824T-3302E/OT 300mA 3.3V 3.5V-6V 0.2V @ 300mA -- -- MCP1824T-3302E/OTCT-ND MIC5205-2.5YM5 TR 150mA 2.5V 2.7-16V 0.165V @ 150mA -- -- 576-1257-2-ND MIC5205-3.0YM5 TR 150mA 3.0V 3.2V-16V 0.165V @ 150mA -- -- 576-1258-2-ND MIC5205-3.3YM5 TR 150mA 3.3V 3.5V-16V 0.165V @ 150mA -- -- 576-1259-2-ND TPS780330220 150mA 3.3V+2.2V 3.6-5.5V 250mV Max -- -- 296-23332-1-ND TDA3663/N1,135 100mA 3.3V 3.5-45V 0.18V @ 50mA -- -- 568-5343-1-ND Max operating temp can be calculated using θJA, TJ (max junction temperature), and power in watts. Set the "Maximum Ambient Temperature" until it reaches TJ ("Max Junction Temperature"), which is the absolute limit for safe use of the regulator: Heat Sink Temperature Calculator <http://www.daycounter.com/Calculators/Heat-Sink-Temperature-Calculator.phtml> For example, With 12V source into a 3.3V LP2985 and a 30mA load, we are dissipating (12V-3.3V) * 0.03A = 0.261W. With a θJA of 206 °C/W, a TJ of 150°C, and 261mW we can safely use the chip without a heat sink up to 75°C (=147.1°C Junction Temperature).
U2 = microbuilder:SPIFLASH_8PIN: SOIC8 SPI Flash Be careful with the size since SOIC8 flash comes in several 'widths' SOIC8 150 mil M25P16 - 16Mbit (2Mbit x 8) Serial Flash (75MHz SPI Bus), Supply: 2.7-3.6V Digikey: SOIC8 - M25P16-VMN6P-ND SOIC8 208 mil W25Q16BVSSIG - 16Mbit (2Mbit x 8) Serial Flash (104MHz SPI Bus), Supply: 2.7-3.6V Digikey: SOIC8 - W25Q16BVSSIG-ND
U3 = microbuilder:VREG_FAN5331: FAN5331 - LED/OLED 20V Boost Converter Digikey: FAN5331SXCT-ND
U4 = microbuilder:PHOTOTRANSISTOR: ALS-PT19-315C - Analog Light Sensor VCC: 2.5-5.5V
U$2 = adafruit_micro:ATSAMD51J: ATSAMD51J cortex m4 microcontroller
U$7 U$15-U$17 = microbuilder:MOUNTINGHOLE: Mounting Hole For #2 screws (0.086"/2.18mm width, 0.094"/2.4mm hole) use 2.5mm; BOM: EXCLUDE
U$9 U$11 U$23 = microbuilder:FIDUCIAL: Fiducial Alignment Points Various fiducial points for machine vision alignment.; BOM: EXCLUDE
X1 = microbuilder:MICROSD: MicroSD/Transflash Card Holder with SPI pinout 3M: 2908-05WB-MG 4UConnector: 19656 Footprint courtesy: Adafruit Industries
X2 = adafruit_display:DISP_LCD_3.5IN_320X480_50PIN: DT350HV15-T - 3.5" 320x480 TFT Display, 50 Pin Connector
X3 = microbuilder:JTAG-CORTEX: Serial Wire (SW-DP) Connector Standard 0.05" 10-pin connector is for use with the Cortex M and Cortex A SWD (serial wire debugger) interface (SW-DP) Connectors 2x05_1.27MM_SMT - Inexpensive surface-mount header with bare pins, compatible with standard 10-pin SWD cables (4UCON: 16846) 2x05_1.27MM_BOX_NOPOSTS - Polarised surface-mount box (4UCON with caps: 19735, without caps: 15117 2x05_1.27MM_BOX_POSTS - Polarised surface-mount box with mounting holes (4UCON: 20317) Pinout: http://infocenter.arm.com/help/topic/com.arm.doc.faqs/attached/13634/cortex_debug_connectors.pdf http://www.keil.com/peripherals/coresight/connectors.asp
X5 = microbuilder:USB_C: USB Type-C USB 2.0 Connector
X6 = microbuilder:ESP32_WROOM32

## Net classes
1 power: width 0.305 mm

## Board
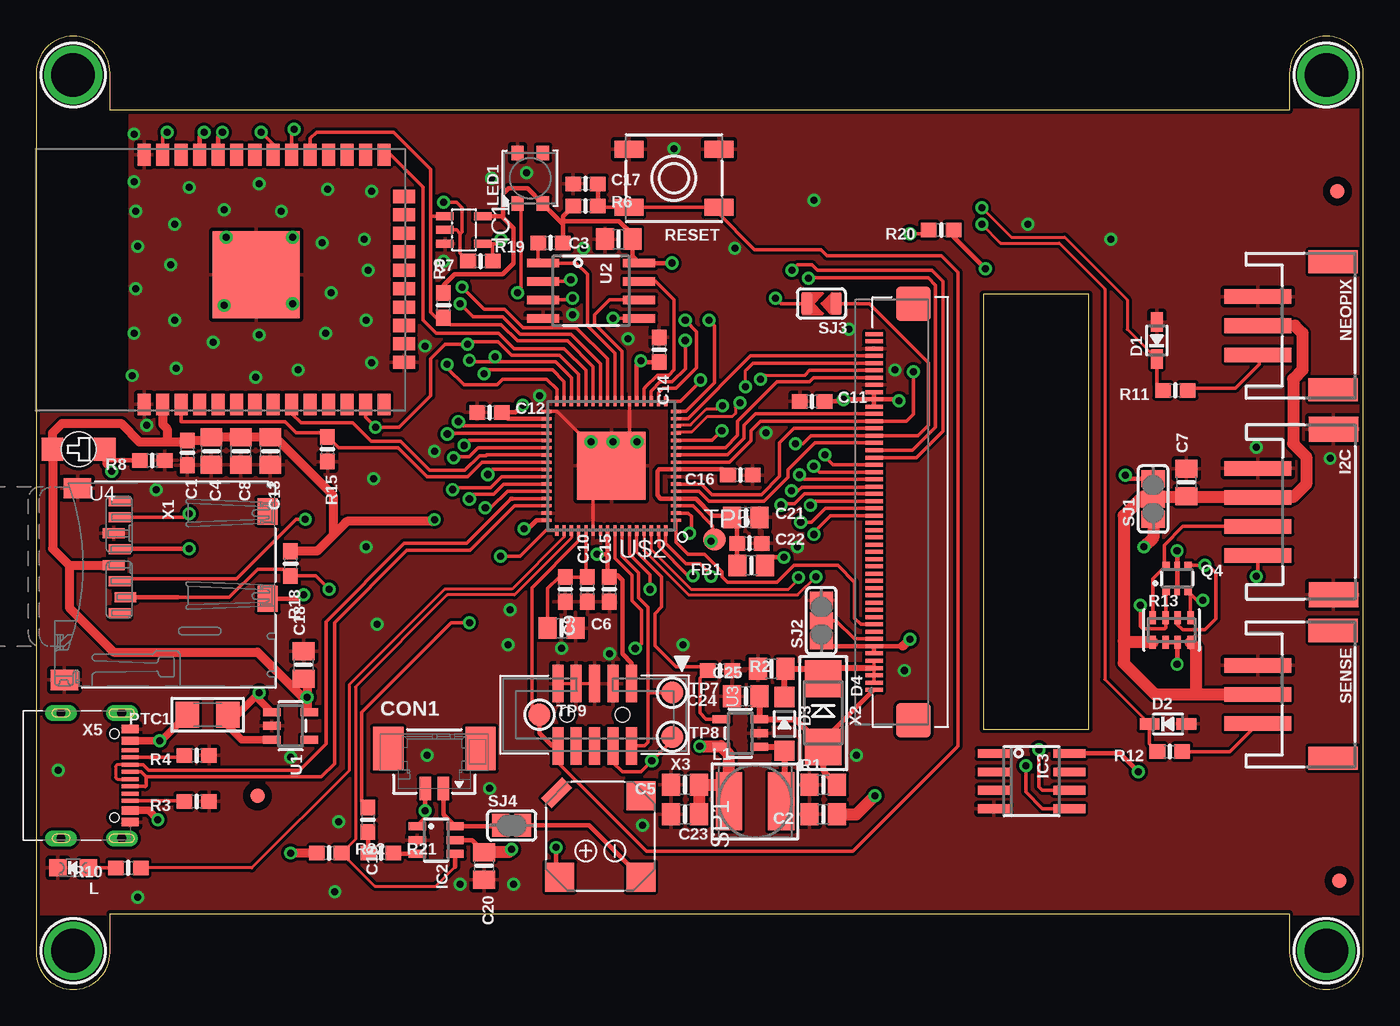
[diagram p3: board, top side]
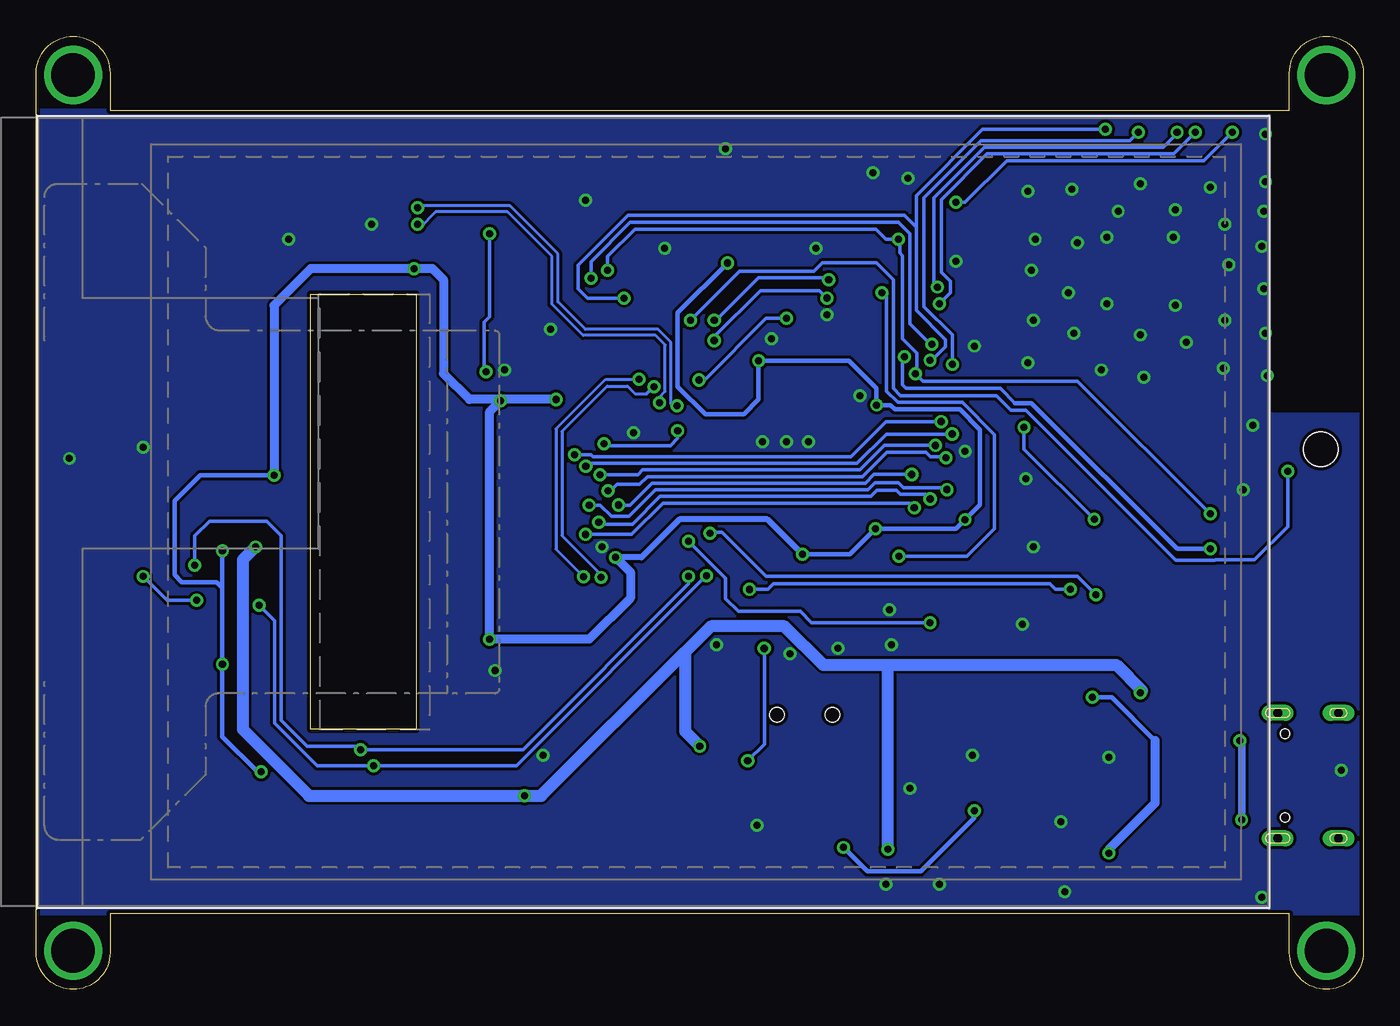
[diagram p4: board, bottom side, seen from below]

Size 91.44 x 65.66 mm. Coordinates in mm from the lower left corner, seen from the top.
Outline: 88.9,0 arc90 91.44,2.54 91.44,63.12 arc90 88.9,65.66 arc90 86.36,63.12 86.36,60.58 5.08,60.58 5.08,63.12 arc90 2.54,65.66 arc90 0,63.12 0,2.54 arc90 2.54,0 arc90 5.08,2.54 5.08,5.21 86.36,5.21 86.36,2.54 arc90 88.9,0
Outline: 65.28,17.91 72.52,17.91 72.52,47.88 65.28,47.88 65.28,17.91
Copper layers (1*16): Top 0.035mm / dielectric 1.5mm / Bottom 0.035mm
Design rules "adafruit *": minimum track width 8mil, minimum drill 19mil, track to track 8mil, track to pad 8mil, pad to pad 8mil, via to via 8mil, smd to smd 8mil, copper to edge 10mil, drill to drill 8mil, minimum pad ring 10mil, minimum via ring 8mil, stop-mask expansion 4mil, vias tented up to drill 20mil, thermal gap 10mil

### Footprints (pad centres in the part's own frame; a part is rotated, then mirrored left to right if it is on the bottom)
0603-NO = smd 1.075 x 1: 1 -0.85,0; 2 0.85,0
0805-NO = smd 1.24 x 1.5: 1 -0.95,0; 2 0.95,0
53398-0271 = smd 0.8 x 1.6: 1 0.625,-1.27; 2 -0.625,-1.27 | smd 2.1 x 3: M1 3.185,1.48; M2 -3.185,1.48
SOD-323 = smd 1.35 x 0.8: A 1.27,0; C -1.27,0
SOD-123 = smd 1.4 x 1.4: A 1.85,0; C -1.85,0
SMADIODE = smd 2.54 x 2.54: A 2.349,0; C -2.349,0
JSTPH4 = smd 1 x 4.6: 1 -3,-3.7; 2 -1,-3.7; 3 1,-3.7; 4 3,-3.7 | smd 1.7 x 3.4: NC1 -5.7,1.5; NC2 5.7,1.5
SOT23-5L = smd 0.55 x 1.2: 1 -0.95,-1.3; 2 0,-1.3; 3 0.95,-1.3; 4 0.95,1.3; 5 -0.95,1.3
SOT23-6 = smd 0.55 x 1.2: 1 -0.95,-1.3; 2 0,-1.3; 3 0.95,-1.3; 4 0.95,1.3; 5 0,1.3; 6 -0.95,1.3
SOIC8_150MIL = smd 0.6 x 2.2: 1 -1.905,-2.6; 2 -0.635,-2.6; 3 0.635,-2.6; 4 1.905,-2.6; 5 1.905,2.6; 6 0.635,2.6; 7 -0.635,2.6; 8 -1.905,2.6
CHIPLED_0805_NOOUTLINE = smd 1.2 x 1.2: A 0,-1.05; C 0,1.05
INDUCTOR_5X5MM_NR5040_NOTHERMALS = smd 1.8 x 4: P$1 -1.8,0; P$2 1.8,0
LED3535 = smd 1 x 0.85: 1 -1.75,0.875; 2 -1.75,-0.875; 3 1.75,-0.875; 4 1.75,0.875
JSTPH3 = smd 1 x 4.6: 1 -2,-2.7; 2 0,-2.7; 3 2,-2.7 | smd 1.6 x 3.4: NC1 -4.4,2.5; NC2 4.4,2.5
1206 = smd 1.6 x 1.8: 1 -1.4,0; 2 1.4,0
SOT363 = smd 0.5 x 0.5: 1 -0.75,-0.9; 3 0.75,-0.9; 4 0.75,0.9; 6 -0.75,0.9 | smd 0.4 x 0.5: 2 0,-0.9; 5 0,0.9
RESPACK_4X0603 = smd 0.45 x 0.9: 1 -1.3,-0.85; 2 -0.4,-0.85; 3 0.4,-0.85; 4 1.3,-0.85; 5 1.3,0.85; 6 0.4,0.85; 7 -0.4,0.85; 8 -1.3,0.85
EVQ-Q2_SMALLER = smd 2 x 1.2: A -3.1,-2; A' 3.1,-2; B -3.1,2; B' 3.1,2
SOLDERJUMPER_2WAY_OPEN_NOPASTE = smd 1.168 x 1.6: 1 -1.397,0; 2 0,0; 3 1.397,0
SOLDERJUMPER_ARROW_NOPASTE = smd 0.762 x 1.524: 1 -1.016,0; 2 1.016,0
SOLDERJUMPER_CLOSEDWIRE = smd 1.168 x 1.6: 1 -0.762,0; 2 0.762,0 | smd 0.635 x 0.203: WIRE 0,0
BUZZER_SMT_7.5MM = smd 2 x 2: + 2.8,-2.8; - 2.8,2.8; MT2 -2.8,2.8 | smd 2 x 1 rotated 135: MT -3,-3
TP15R = smd 1.5 x 1.5: TP 0,0
TESTPOINT_ROUND_1.5MM = smd 1.5 x 1.5: P$1 0,0
SOT23-5 = smd 0.55 x 1.2: 1 -0.95,-1.3; 2 0,-1.3; 3 0.95,-1.3; 4 0.95,1.3; 5 -0.95,1.3
SOIC8_208MIL = smd 0.6 x 2.2: 1 -1.905,-3.315; 2 -0.635,-3.315; 3 0.635,-3.315; 4 1.905,-3.315; 5 1.905,3.315; 6 0.635,3.315; 7 -0.635,3.315; 8 -1.905,3.315
ALS-PT26-21C = smd 1.5 x 1.6: 1_E -1.8,0; 2_C 1.8,0 | hole 2.4: 0,0
PQFN64-1 = smd 0.7 x 0.22: 1 -4.45,3.75; 2 -4.45,3.25; 3 -4.45,2.75; 4 -4.45,2.25; 5 -4.45,1.75; 6 -4.45,1.25; 7 -4.45,0.75; 8 -4.45,0.25; 9 -4.45,-0.25; 10 -4.45,-0.75; 11 -4.45,-1.25; 12 -4.45,-1.75; 13 -4.45,-2.25; 14 -4.45,-2.75; 15 -4.45,-3.25; 16 -4.45,-3.75; 33 4.45,-3.75; 34 4.45,-3.25; 35 4.45,-2.75; 36 4.45,-2.25; 37 4.45,-1.75; 38 4.45,-1.25; 39 4.45,-0.75; 40 4.45,-0.25; 41 4.45,0.25; 42 4.45,0.75; 43 4.45,1.25; 44 4.45,1.75; 45 4.45,2.25; 46 4.45,2.75; 47 4.45,3.25; 48 4.45,3.75 | smd 0.22 x 0.7: 17 -3.75,-4.45; 18 -3.25,-4.45; 19 -2.75,-4.45; 20 -2.25,-4.45; 21 -1.75,-4.45; 22 -1.25,-4.45; 23 -0.75,-4.45; 24 -0.25,-4.45; 25 0.25,-4.45; 26 0.75,-4.45; 27 1.25,-4.45; 28 1.75,-4.45; 29 2.25,-4.45; 30 2.75,-4.45; 31 3.25,-4.45; 32 3.75,-4.45; 49 3.75,4.45; 50 3.25,4.45; 51 2.75,4.45; 52 2.25,4.45; 53 1.75,4.45; 54 1.25,4.45; 55 0.75,4.45; 56 0.25,4.45; 57 -0.25,4.45; 58 -0.75,4.45; 59 -1.25,4.45; 60 -1.75,4.45; 61 -2.25,4.45; 62 -2.75,4.45; 63 -3.25,4.45; 64 -3.75,4.45 | smd 4.7 x 4.7: EXP 0,0
MOUNTINGHOLE_3.0_PLATEDTHIN = drill 3 pad 3.6: P$1 0,0
FIDUCIAL_1MM = smd 1 x 1: 1 0,0
MICROSD = smd 0.7 x 1.5: 1 9,-10.64; 2 7.9,-10.24; 3 6.8,-10.64; 4 5.7,-11.04; 5 4.6,-10.64; 6 3.5,-11.04; 7 2.4,-10.64; 8 1.3,-10.64 | smd 1.8 x 1.4: CD1 2,-0.44; CD2 8,-0.44 | smd 1.4 x 1.9: MT1 0.4,-13.54; MT2 13.6,-14.44
TFT_3.5IN_320X480_50PIN = smd 0.275 x 1.2 bottom: 1 12.25,-3.76; 2 11.75,-3.76; 3 11.25,-3.76; 4 10.75,-3.76; 5 10.25,-3.76; 6 9.75,-3.76; 7 9.25,-3.76; 8 8.75,-3.76; 9 8.25,-3.76; 10 7.75,-3.76; 11 7.25,-3.76; 12 6.75,-3.76; 13 6.25,-3.76; 14 5.75,-3.76; 15 5.25,-3.76; 16 4.75,-3.76; 17 4.25,-3.76; 18 3.75,-3.76; 19 3.25,-3.76; 20 2.75,-3.76; 21 2.25,-3.76; 22 1.75,-3.76; 23 1.25,-3.76; 24 0.75,-3.76; 25 0.25,-3.76; 26 -0.25,-3.76; 27 -0.75,-3.76; 28 -1.25,-3.76; 29 -1.75,-3.76; 30 -2.25,-3.76; 31 -2.75,-3.76; 32 -3.25,-3.76; 33 -3.75,-3.76; 34 -4.25,-3.76; 35 -4.75,-3.76; 36 -5.25,-3.76; 37 -5.75,-3.76; 38 -6.25,-3.76; 39 -6.75,-3.76; 40 -7.25,-3.76; 41 -7.75,-3.76; 42 -8.25,-3.76; 43 -8.75,-3.76; 44 -9.25,-3.76; 45 -9.75,-3.76; 46 -10.25,-3.76; 47 -10.75,-3.76; 48 -11.25,-3.76; 49 -11.75,-3.76; 50 -12.25,-3.76 | smd 2.4 x 2.4 bottom: PAD1 14.35,-6.46; PAD2 -14.35,-6.46
2X05_1.27MM_BOX_POSTS = smd 0.76 x 2.6: 1 -2.54,-2.15; 2 -2.54,2.15; 3 -1.27,-2.15; 4 -1.27,2.15; 5 0,-2.15; 6 0,2.15; 7 1.27,-2.15; 8 1.27,2.15; 9 2.54,-2.15; 10 2.54,2.15 | hole 1: -1.905,0; 1.905,0
USB_C_CUSB31-CFM2AX-01-X = smd 0.575 x 1.15: A1B12 -3.2,3.545; A4B9 -2.4,3.545; B1A12 3.2,3.545; B4A9 2.4,3.545 | smd 0.275 x 1.15: A5 -1.25,3.545; A6 -0.25,3.545; A7 0.25,3.545; A8 1.25,3.545; B5 1.75,3.545; B6 0.75,3.545; B7 -0.75,3.545; B8 -1.75,3.545 | drill 0.6 pad 1 long: M1 -4.32,2.97; M2 4.32,2.97; M3 -4.32,-1.21; M4 4.32,-1.21 | hole 0.65: 2.89,2.47; -2.89,2.47
WROOM32 = smd 1.5 x 0.9: 1 -8.6,5; 2 -8.6,3.73; 3 -8.6,2.46; 4 -8.6,1.19; 5 -8.6,-0.08; 6 -8.6,-1.35; 7 -8.6,-2.62; 8 -8.6,-3.89; 9 -8.6,-5.16; 10 -8.6,-6.43; 11 -8.6,-7.7; 12 -8.6,-8.97; 13 -8.6,-10.24; 14 -8.6,-11.51; 25 8.6,-11.51; 26 8.6,-10.24; 27 8.6,-8.97; 28 8.6,-7.7; 29 8.6,-6.43; 30 8.6,-5.16; 31 8.6,-3.89; 32 8.6,-2.62; 33 8.6,-1.35; 34 8.6,-0.08; 35 8.6,1.19; 36 8.6,2.46; 37 8.6,3.73; 38 8.6,5 | smd 0.9 x 1.5: 15 -5.7,-12.9; 16 -4.43,-12.9; 17 -3.16,-12.9; 18 -1.89,-12.9; 19 -0.62,-12.9; 20 0.65,-12.9; 21 1.92,-12.9; 22 3.19,-12.9; 23 4.46,-12.9; 24 5.73,-12.9 | smd 6 x 6: P$1 0.34,-2.7

### Placement (x,y rotation side)
C1  10.41,36.96 270 top
C2  54.23,12.06 180 top
C3  40.13,51.69 180 top
C4  12.07,37.08 270 top
C5  44.7,14.1 180 top
C6  36.2,24.89 0 top
C7  79.25,34.92 90 top
C8  14.1,37.08 270 top
C9  36.45,27.56 270 top
C10  37.97,27.56 90 top
C11  53.47,40.51 0 top
C12  31.24,39.75 0 top
C13  16.13,37.08 270 top
C14  42.93,44.07 270 top
C15  39.5,27.56 90 top
C16  48.51,35.43 180 top
C17  37.85,55.5 0 top
C18  18.41,22.35 90 top
C19  22.86,11.68 270 top
C20  30.86,8.51 270 top
C21  48.89,32.51 0 top
C22  49.15,30.73 0 top
C23  44.7,12.06 180 top
C24  48.89,20.19 180 top
C25  50.67,22.1 180 top
CON1  27.43,15.11 0 top
D1  77.22,44.7 90 top
D2  77.98,18.29 0 top
D3  51.56,18.29 270 top
D4  54.23,19.05 270 top
FB1  49.28,29.21 180 top
I2C  87.88,32.89 270 top
IC1  29.46,52.32 270 top
IC2  27.56,10.29 270 top
IC3  68.58,14.35 270 top
L  2.54,8.38 90 top
L1  49.53,12.95 0 top
LED1  34.04,55.88 90 top
NEOPIX  86.87,45.72 270 top
PTC1  11.81,18.92 180 top
Q4  78.61,28.32 0 top
R1  54.23,14.1 0 top
R2  47.12,21.97 0 top
R3  11.05,12.95 180 top
R4  11.05,16.13 180 top
R6  37.85,53.98 0 top
R7  30.61,50.16 180 top
R8  8,36.45 180 top
R9  28.07,47.12 90 top
R10  6.35,8.38 180 top
R11  78.49,41.27 180 top
R12  78.11,16.38 180 top
R13  78.23,24.77 0 top
R15  20.07,37.21 270 top
R18  17.53,29.34 270 top
R19  35.43,51.44 180 top
R20  62.36,52.32 180 top
R21  23.75,9.4 0 top
R22  20.19,9.4 0 top
RESET  43.94,55.88 180 top
SENSE  86.87,20.32 270 top
SJ1  76.96,33.78 90 top
SJ2  54.1,25.4 90 top
SJ3  54.1,47.24 180 top
SJ4  32.77,11.3 0 top
SP1  38.86,10.54 270 top
TP5  46.74,30.99 0 top
TP7  43.81,20.45 0 top
TP8  43.81,17.4 0 top
TP9  34.67,18.92 0 top
U1  17.53,18.16 270 top
U2  38.23,48.13 270 top
U3  48.51,17.65 90 top
U4  2.92,37.21 180 top
U$2  39.62,36.07 180 top
U$7  88.9,2.67 90 top
U$9  89.66,54.99 90 top
U$11  15.24,13.34 90 top
U$15  88.9,62.99 90 top
U$16  2.54,2.67 90 top
U$17  2.54,62.99 90 top
U$19  [PYPORTALTITANO_BOT]  91.44,0.13 0 bottom
U$23  89.79,7.49 90 top
U$54  [PYPORTALTITANO_TOP]  0,0.13 0 top
X1  16.38,34.92 270 top
X2  53.98,32.89 270 bottom
X3  38.48,18.92 180 top
X5  2.92,14.73 270 top
X6  12.45,48.9 90 top

### Tracks (layer width: path | path; a pad name or v marks a point on that pad's centre or on a via)
3.3V  (via drill 0.48, 0.5)
  Top 0.305: 57.4,40.64 57.65,40.64 57.73,40.73 X2.42 | 57.4,40.64 v55.63,40.64 55.5,40.51 C11.2 | 34.9,54.13 33.84,55.18 32.53,55.18 32.17,54.82 32.17,53.27 | 36.28,52.96 36.27,52.96 36.27,52.76 36.1,52.92 | R6.1 36.28,53.26 36.28,52.96 | 36.28,52.96 36.28,52.83 | U$2.56 39.37,29.97 | 39.37,29.97 39.37,28.53 | X3.1 41.02,22.48 40.39,23.11 40.39,28.19 40.05,28.53 39.37,28.53 | v43.81,50.04 U2.8 41.08,50.5 C3.1 41.08,52.01 40.17,52.92 36.38,52.92 | U$2.48 34.48,32.32 34.04,31.88 33.75,31.88 v33.61,31.74 | 39.37,29.97 v38.65,29.97 | v33.53,40.26 33.02,39.75 C12.2 32.52,39.32 U$2.34 | SJ1.3 75.31,35.18 v75.06,35.43 | C4.1 11.84,37.81 | C1.1 10.31,37.71 | 36.38,52.92 36.28,52.83 | v27.43,32.37 27.3,32.24 | LED1.2 34.9,54.13 | 36.1,52.92 34.9,54.13 | C14.2 41.74,43.22 v41.66,43.31 41.37,43.02 U$2.21 | R9.2 28.07,48.51 28.83,49.28 32.13,49.28 32.89,50.04 32.89,52.45 32.17,53.18 32.17,53.27 | 32.17,53.27 IC1.5 | X2.41 57.41,40.64 57.4,40.64 | X2.41 X2.40 | X2.6 X2.7 | X2.7 54.46,23.64 SJ2.1 | Q4.2 Q4.5 v78.61,30.23 | R13.2 78.61,23.91 | 78.61,23.91 R13.3 | 78.61,23.91 v78.61,22.39 | 36.38,52.92 36.1,52.92 | R19.1 36.28,52.83 | 21.41,32.24 21.32,32.15 | 20.45,31.28 21.32,32.15 | 21.32,32.15 | X2.7 59.71,23.64 | v59.44,40.56 59.36,40.64 X2.41 | C13.1 | C13.1 16.45,38.03 | R20.1 63.21,51.86 v65.41,49.66 | FB1.1 50.77,29.76 v51.52,29.76 | C15.2 39.37,28.53 | v75.95,14.99 74.68,16.26 IC3.8
  Top 0.61: 11.84,37.81 C1.1 | X6.2 8.72,38.92 9.02,38.62 9.02,37.71 | 10.31,37.71 9.02,37.71 | 9.02,37.71 7.12,37.71 5.84,38.99 1.78,38.99 1.12,38.33 U4.2_C 1.12,30.38 2.27,29.23 | 2.27,29.23 X1.4 | C18.1 18.67,21.15 v18.67,20.13 | 2.27,29.23 2.27,26.3 5.33,23.24 15.24,23.24 18.35,20.13 v18.67,20.13 | U1.5 18.67,19.27 v18.67,20.13 | C4.1 C8.1 C13.1 | 16.45,38.03 20.45,34.04 20.45,31.28 | 27.3,32.24 21.41,32.24 | R22.1 v17.53,9.4 | R18.1 19.35,30.19 21.32,32.15 | 59.71,23.64 v60.2,24.13
  Bottom 0.305: v38.65,29.97 35.37,29.97 v33.61,31.74 33.59,31.75 28.05,31.75 v27.43,32.37 26.42,33.39 26.42,38.56 27.81,39.95 32.27,39.95 32.57,40.26 v33.53,40.26 33.53,41.4 35.43,43.31 v41.66,43.31 41.66,40.64 42.67,39.62 45.34,39.62 47.24,41.53 47.24,46.61 v43.81,50.04 | v18.67,20.13 17.33,20.13 14.35,17.14 | 17.53,9.65 v17.53,9.4 | 78.61,27.69 v78.61,22.39 78.61,17.4 76.2,14.99 v75.95,14.99 | 78.61,27.69 v78.61,30.23 | 78.61,27.69 78.99,28.07 81.41,28.07 81.91,28.57 81.91,33.66 80.14,35.43 v75.06,35.43
  Bottom 0.406: v38.65,29.97 41.06,32.38 47.12,32.38 49.74,29.76 v51.52,29.76
  Bottom 0.61: v75.06,35.43 75.06,47.12 72.52,49.66 v65.41,49.66 64.14,49.66 63.37,48.9 63.37,42.42 61.59,40.64 v55.63,40.64 | 14.35,17.14 14.35,12.83 17.53,9.65 | v59.44,40.56 60.2,39.8 v60.2,24.13 53.34,24.13 50.51,26.96 50.51,28.74 v51.52,29.76
!RESET
  Top 0.254: 38.76,54.42 38.7,54.36 R6.2 38.79,53.88 RESET.B' 46.48,53.88 46.86,53.88 46.86,53.6 49.5,50.96 54.07,50.96 54.48,50.55 62.36,50.55 63.5,49.4 63.5,16.76 56.26,9.52 42.04,9.52 35.94,15.62 X3.10 35.55,16.77 | U$2.52 37.37,30.9 34.16,27.69 34.16,19.43 TP9.P$1
  Top 0.305: 35.55,16.77 34.67,17.65 TP9.P$1 | 38.76,54.42 38.7,54.48 C17.2 | RESET.B 46.48,53.88
+5V  (via drill 0.48)
  Top 0.305: C20.1 30.03,10.29 IC2.5 | PTC1.1 13.34,18.92 13.84,18.92
  Top 0.406: L1.P$1 47.73,14.1 | 47.15,16.76 U3.5
  Top 0.508: 13.84,18.92 v15.37,20.45 15.37,19.97 U1.1 | U1.3 14.16,17.21 13.34,18.03 13.34,18.92
  Top 0.813: SJ1.1 76.96,31.12 v76.33,30.48 | v32.77,9.65 32.57,9.46 C20.1 | U3.5 47.73,16.19 47.73,14.1 C5.1 C23.1 | v45.72,16.76 47.15,16.76 | C2.1 56.52,12.06 v57.78,13.34
  Bottom 0.305: 15.24,20.57 v15.37,20.45
  Bottom 0.813: 32.77,22.35 37.21,22.35 39.88,25.02 44.96,25.02 46.74,23.24 | 32.77,22.35 17.02,22.35 15.24,20.57 | v76.33,30.48 77.22,29.59 77.22,17.91 72.64,13.34 v57.78,13.34 56.64,13.34 46.74,23.24 | v32.77,9.65 32.77,22.35 | 46.74,23.24 46.74,17.78 v45.72,16.76
+24V
  Top 0.254: X2.2 X2.3 X2.4 X2.5
  Top 0.406: D3.C 51.56,22.04 C25.1 53.53,22.1 53.88,21.75 | 53.88,21.75 D4.C | X2.4 54.27,22.14 53.88,21.75
AUDIO_OUT  (via drill 0.48)
  Top 0.254: U$2.3 45.25,33.32 46.61,31.96 46.61,31.12 TP5.TP | v29.84,25.27 28.59,25.27 22.42,19.11 22.42,12.97 C19.1
  Top 0.305: TP5.TP 46.61,30.86 v46.48,30.86
  Bottom 0.254: v46.48,30.86 43.94,28.32 43.94,26.92 43.07,26.05 38.8,26.05 38.02,25.27 v29.84,25.27
AVDD
  Top 0.305: C16.2 47.28,35.82 U$2.8 42.93,35.82 42.8,35.69 42.8,34.04 43.02,33.82 U$2.4 44.09,33.8 45.45,33.8 46.61,32.64 47.82,32.64 C21.1 48.3,32.16 C22.1 48.3,29.24 FB1.2
CARDDET  (via drill 0.48)
  Top 0.254: U$2.2 44.91,32.82 45.14,32.59 45.14,31.55 v45.01,31.42
  Top 0.305: v18.41,27.18 18.16,26.93 X1.CD2
  Bottom 0.254: v45.01,31.42 45.01,31.5 44.2,31.5 41.15,28.45 19.69,28.45 v18.41,27.18
CC1
  Top 0.254: X5.A5 10.05,15.98 R4.2
CC2
  Top 0.254: X5.B5 10.17,12.98 R3.2
D3
  Top 0.254: R12.1 82.23,16.38 SENSE.3
D3_UNSAFE  (via drill 0.48)
  Top 0.203: U$2.13 44.16,38.4 45.18,38.4 46.24,39.47 47.98,39.47 48.19,39.68 48.19,40.1 | v65.15,52.7 66.45,51.41 70.48,51.41 73.64,48.26 73.64,21.36 D2.C
  Top 0.254: D2.C 76.71,16.93 R12.2 | v48.5,40.42 48.19,40.1
  Bottom 0.203: v48.5,40.42 48.5,40.8 48.11,41.2 48.11,44.41 48.76,45.06 53.76,45.06 55.91,47.2 55.91,50.51 58.97,53.57 63.91,53.57 65.02,52.45 65.02,52.58 v65.15,52.7
D4
  Top 0.254: 84.3,43.56 84.3,43.06 82.64,41.4 79.46,41.4 R11.1
  Top 0.305: NEOPIX.3 84.17,43.69 84.3,43.56
D4_UNSAFE  (via drill 0.48)
  Top 0.203: U$2.14 44.14,38.89 45.09,38.89 46.16,39.97 47.03,39.97 v47.28,40.22 | v65.15,53.85 67.18,51.82 70.87,51.82 75.18,47.5 75.18,45.47 D1.C
  Top 0.254: R11.2 77.22,41.7 D1.C
  Bottom 0.203: v47.28,40.22 47.6,40.22 47.7,40.32 47.7,44.58 48.59,45.47 53.59,45.47 55.5,47.37 55.5,50.67 58.8,53.98 65.02,53.98 v65.15,53.85
D13
  Top 0.203: R10.1 14.86,8.38 21.58,15.11 21.58,21.02 28.15,27.58 32.78,27.58 36.37,31.18 U$2.50
D+
  Top 0.254: U$2.46 32.96,33.32 29.89,30.25 25.53,30.25 20.55,25.27 20.55,15.56 19.64,14.66 7.56,14.66 | X5.A6 7.23,14.98 7.56,14.66 | X5.B6 7.48,13.98 7.49,13.97 7.56,14.04 7.56,14.66
D-
  Top 0.203: X5.B7 5.58,15.48 5.46,15.37 5.46,14.61 5.58,14.48 X5.A7
  Top 0.254: 32.81,33.82 U$2.45 | 32.72,33.82 29.64,30.73 25.36,30.73 19.96,25.34 19.96,16.93 18.15,15.11 7.75,15.11 7.37,15.49 X5.B7
  Top 0.305: 32.72,33.82 32.81,33.82
ESP_BUSY
  Top 0.254: X6.9 17.61,39.66 18.24,39.02 21.81,39.02 23.08,37.76 25.12,37.76 27.11,35.76 29.53,35.76 30.54,36.77 30.99,36.77 31.03,36.82 U$2.39
ESP_CS
  Top 0.254: X6.29 18.88,58.63 19.3,59.05 24.64,59.05 27.18,56.52 27.18,53.27 | U$2.27 38.37,42.91 36.6,44.68 33.15,44.68 32.04,45.79 28.54,45.79 R9.1 27.56,46.27 27.18,46.65 27.18,53.27 | IC1.1 27.18,53.27
ESP_GPIO0
  Top 0.254: U$2.28 37.87,42.66 36.38,44.15 32.93,44.15 31.87,45.21 27.56,45.21 26.67,46.1 26.67,55.24 24.42,57.49 X6.25
ESP_MISO  (via drill 0.48)
  Top 0.254: IC1.2 28.96,52.32 29.21,52.07 | 29.21,52.07 29.21,50.71 R7.2 | X6.37 8.72,58.75 v9.02,59.05 | v28.07,54.23 28.96,54.23 29.34,53.85 29.34,52.2 29.21,52.07
  Bottom 0.254: v9.02,59.05 10.97,57.1 24.56,57.1 27.43,54.23 v28.07,54.23
ESP_RESET
  Top 0.254: X6.3 9.99,39.12 17.14,39.12 17.91,38.35 20.07,38.35 R15.1 20.83,37.3 24.93,37.3 26.92,35.31 29.72,35.31 30.73,36.32 U$2.40
ESP_RTS  (via drill 0.48, 0.5)
  Top 0.254: X6.31 16.34,58.21 v15.49,59.05 | U$2.32 35.87,41.34 35.18,42.04 32.13,42.04 31.74,41.65 29.47,41.65 28.32,42.8 v28.32,43.05
  Bottom 0.254: v15.49,59.05 16.08,58.47 26.35,58.47 30.28,54.55 30.28,47.04 | v28.32,43.05 28.32,45.09 30.28,47.04 | 30.28,47.04
GND  (via drill 0.48)
  Top 0.203: X3.9 X3.7 X3.5
  Top 0.254: U$2.54 38.37,34.82 U$2.EXP | U$2.22 40.87,37.32 U$2.EXP | U$2.33 35.87,39.82 U$2.EXP
  other vias: 43.94,57.91 37.72,51.05 38.23,37.72 39.75,37.72 41.4,37.72 34.67,40.89 18.03,42.67 27.43,37.08 44.58,23.75 36.2,23.5 39.5,23.11 59.82,21.97 59.18,42.67 56.01,45.47 40.77,44.83 36.96,46.48 31.37,55.88 6.86,53.59 68.33,52.7 74.04,51.69 89.15,36.58 84.07,37.34 6.73,58.93 13.08,51.82 17.65,51.82 17.65,47.24 12.95,47.12 20.07,55.12 23.11,54.99 8.25,34.42 7.62,38.86 23.24,35.18 31.24,13.84 20.57,6.73 26.92,16.13 23.49,25.15 20.83,11.56 1.52,15.11 17.53,16 26.8,44.32 53.59,54.36 48.13,51.05 33.78,56.26 32.89,7.24 29.21,7.24 28.07,50.16 6.99,51.18 6.86,48.26 6.73,45.21 6.6,42.29 6.73,55.63 10.54,55.24 9.27,49.91 9.53,46.1 9.65,42.8 12.19,44.58 15.11,42.16 15.37,45.09 19.94,45.21 23.11,43.18 22.73,46.1 22.86,49.53 20.32,48.01 19.69,51.44 22.61,51.69 16.89,53.59 15.37,55.5 12.95,53.72 9.53,52.7 56.52,16.13 41.78,11.3 50.29,38.35 52.45,30.48 22.73,30.48 32.51,23.75 32.64,26.16 6.99,6.35
  pour Top: 6.48,60.58 91.57,60.58 91.57,5.21 0,5.21 0,39.62 6.48,39.62
  pour Bottom: 6.48,60.58 91.57,60.58 91.57,5.21 0,5.21 0,39.62 6.48,39.62
LCD_DATA0  (via drill 0.5)
  Top 0.254: v29.08,39.12 29.38,38.82 U$2.35 | v54.36,36.83 54.36,36.7 54.92,36.14 X2.32
  Bottom 0.254: v29.08,39.12 32.89,39.12 35.31,36.7 53.09,36.7 53.21,36.83 v54.36,36.83
LCD_DATA1  (via drill 0.5)
  Top 0.254: v28.32,38.26 28.32,38.32 U$2.36 | v53.57,36.05 53.97,35.64 X2.31
  Bottom 0.254: v53.57,36.05 53.46,36.05 53.26,36.25 34.87,36.25 32.86,38.26 v28.32,38.26
LCD_DATA2  (via drill 0.5)
  Top 0.254: v29.49,37.48 29.83,37.82 U$2.37 | v52.59,35.46 52.91,35.14 X2.30
  Bottom 0.254: v29.49,37.48 33,37.48 34.69,35.79 49.66,35.79 49.98,35.46 v52.59,35.46
LCD_DATA3  (via drill 0.5)
  Top 0.254: U$2.38 30.44,37.32 29.81,36.69 28.82,36.69 v28.76,36.63 | v52.03,34.35 52.49,34.35 52.75,34.61 57.7,34.61 X2.29
  Bottom 0.254: v28.76,36.63 28.82,36.69 29.81,36.69 30.14,37.02 32.81,37.02 34.49,35.33 49.32,35.33 49.86,34.8 51.43,34.8 51.88,34.35 v52.03,34.35
LCD_DATA4  (via drill 0.5)
  Top 0.254: U$2.41 31.46,35.82 v31.12,35.47 | X2.28 52.93,34.14 52.23,33.44 51.39,33.44 v51.32,33.37
  Bottom 0.254: v31.12,35.47 33.71,35.47 34.31,34.87 49.02,34.87 50.53,33.37 v51.32,33.37
LCD_DATA5  (via drill 0.5)
  Top 0.254: U$2.42 32.07,35.32 31.31,34.56 28.81,34.56 v28.68,34.43 | v53.34,33.35 53.34,33.64 X2.27
  Bottom 0.254: v28.68,34.43 28.81,34.56 31.69,34.56 32.02,34.89 33.64,34.89 34.12,34.42 48.77,34.42 50.6,32.59 51.82,32.59 52.58,33.35 v53.34,33.35
LCD_DATA6  (via drill 0.5)
  Top 0.254: v52.68,32.18 53.41,32.18 54.37,33.14 X2.26 | U$2.43 32.21,34.82 31.5,34.11 30.17,34.11 v29.84,33.78
  Bottom 0.254: v52.68,32.18 52.55,32.06 50.36,32.06 48.45,33.96 33.93,33.96 33.5,34.39 32.16,34.39 31.88,34.11 30.17,34.11 v29.84,33.78
LCD_DATA7  (via drill 0.5)
  Top 0.254: U$2.44 32.46,34.32 31.32,33.18 v30.94,33.18 | v53.59,31.35 53.59,31.5 54.74,32.64 X2.25
  Bottom 0.254: v53.59,31.35 50.42,31.35 48.26,33.5 31.26,33.5 v30.94,33.18
LEDK
  Top 0.305: X2.1 54.07,16.98 54.07,16.86
  Top 0.406: C24.1 49.84,18.63 U3.3 52.33,18.6 54.07,16.86 D4.A 54.23,15.12 54.34,15.02 54.34,14.94 R1.2
LIGHT  (via drill 0.48)
  Top 0.254: U$2.16 44.76,39.82 46.74,41.8 46.74,45.72 v46.35,46.1
  Top 0.305: R8.2 4.72,36.45 U4.1_E 4.72,36.17 v5.21,35.69
  Bottom 0.254: v46.35,46.1 42.98,49.48 37.86,49.48 37.28,50.06 33.55,50.06 32.38,48.9 32.38,41.4 31.88,40.89 25.27,40.89 24.28,39.9 23.24,39.9 12.92,29.58 10.22,29.58 10.21,29.59 7.49,29.59 5.21,31.88 v5.21,35.69
MISO  (via drill 0.48)
  Top 0.254: U$2.31 36.37,41.86 35.56,42.67 32.4,42.67 32.39,42.68 30.99,42.68 30.87,42.55 v30.87,42.42 | X1.7 10.17,32.52 10.29,32.64 10.41,32.64 v10.54,32.77 | v52.07,49.53 52.45,49.91 53.47,49.91 53.85,49.53 61.72,49.53 62.48,48.77 62.48,38.47 60.66,36.64 X2.33 | v32.02,51.69 31.7,51.37 31.46,51.37 31.46,51.31 | 31.46,51.31 R7.1 | IC1.4 31.39,51.37 31.46,51.31
  Bottom 0.254: v52.07,49.53 52.07,50.5 50.19,52.38 33.58,52.38 32.89,51.69 v32.02,51.69 31.94,51.61 31.94,50.74 31.75,50.55 31.75,44.83 30.74,43.82 30.74,42.55 v30.87,42.42 30.35,41.91 19.69,41.91 v10.54,32.77
MOSI  (via drill 0.48)
  Top 0.254: U$2.29 37.37,42.38 36.07,43.69 32.74,43.69 31.82,44.61 29.91,44.61 v29.73,44.43 28.18,44.43 27.18,43.43 27.18,40.91 25.01,38.73 v23.37,38.73 22.69,39.42 X6.13 | v53.21,48.98 53.25,49.02 61.47,49.02 61.98,48.51 61.98,38.73 60.39,37.14 X2.34 | X1.3 5.9,28.28 13.8,28.28 17.91,32.38 v18.54,32.38
  Bottom 0.254: v53.21,48.98 53.21,50.13 50.51,52.83 32.02,52.83 31.24,52.06 31.24,45.85 29.83,44.43 v29.73,44.43 | v23.37,38.73 23.37,37.21 v18.54,32.38
N$5
  Top 0.254: X2.8 56.38,24.14 55.12,25.4 SJ2.2
N$6
  Top 0.406: U3.1 51.3,16.7 D3.A 51.56,13.19 L1.P$2
N$8
  Top 0.254: R10.2 L.A
N$9
  Top 0.305: 54.1,26.92 54.1,25.4
N$10
  Top 0.254: C19.2 22.86,10.41
  Top 0.305: R21.1 22.86,9.44 22.86,10.41
N$11
  Top 0.305: IC2.3 24.66,9.34 R21.2
N$13
  Top 0.305: SJ4.2 38.1,11.3 SP1.-
NEOPIX  (via drill 0.48)
  Top 0.254: U$2.49 35.11,31.62 33.34,29.84 v32.01,29.84 v32,29.85 | LED1.1 33.41,53.88 33.41,48.26 v33.16,48.01
  Bottom 0.254: v32,29.85 27.3,29.85 25.4,31.75 25.4,38.23 27.61,40.44 32.07,40.44 32.84,41.21 32.84,47.69 v33.16,48.01
QSPI_CS
  Top 0.254: U$2.24 39.87,43.82 37.97,45.72 37.97,49.28 37.21,50.04 U2.1 34.58,50.37 R19.2
QSPI_DATA[0]  (via drill 0.5)
  Top 0.254: v45.78,41.98 45.78,41.91 44.39,40.52 U$2.17 | v39.75,46.23 U2.5
  Bottom 0.254: v39.75,46.23 40.26,46.23 41.15,46.23 45.4,41.98 v45.78,41.98 | v39.75,46.23
QSPI_DATA[1]  (via drill 0.5)
  Top 0.254: v44.73,46.1 45.51,45.32 45.51,42.84 44.07,41.4 43.18,41.4 42.87,41.1 U$2.18 | v36.83,48.9 36.7,48.77 U2.2
  Bottom 0.254: v44.73,46.1 44.6,46.1 41.68,49.02 36.96,49.02 v36.83,48.9
QSPI_DATA[2]  (via drill 0.5)
  Top 0.254: U2.3 36.83,47.5 v36.96,47.62 | U$2.19 42.37,41.22 42.42,41.26 42.42,41.29 42.99,41.86 43.81,41.86 44.73,42.77 v44.73,44.7
  Bottom 0.254: v36.96,47.62 37.46,48.13 41.55,48.13 44.73,44.96 v44.73,44.7
QSPI_DATA[3]
  Top 0.254: U$2.20 41.87,41.37 41.96,41.45 41.96,41.48 42.8,42.32 43.59,42.32 43.94,42.67 43.94,47.5 42.67,48.77 U2.7
QSPI_SCK
  Top 0.254: U$2.23 40.37,43.97 38.48,45.86 38.48,46.48 39.5,47.5 U2.6
RXD  (via drill 0.48)
  Top 0.254: U$2.26 38.87,43.1 36.84,45.14 33.34,45.14 32.12,46.36 30.1,46.36 v29.21,47.24
  Top 0.305: X6.35 11.26,58.75 v11.56,59.05
  Bottom 0.254: v11.56,59.05 13.06,57.56 25.92,57.56 29.08,54.4 29.08,49.4 28.45,48.77 28.45,48.01 v29.21,47.24
SCK  (via drill 0.48)
  Top 0.254: U$2.30 36.87,42.13 35.78,43.23 31.62,43.23 | X6.30 17.61,59.07 v17.78,59.24 | v29.84,43.34 29.95,43.23 31.62,43.23 | SJ3.2 51.31,47.24 v50.93,47.62 | v31.61,43.58 31.62,43.56 31.62,43.23
  Top 0.305: v10.54,30.35 5.77,30.35 X1.5
  Bottom 0.254: 24,40.39 25.02,41.4 31.5,41.4 31.75,41.66 31.75,43.14 31.61,43.28 v31.61,43.58 | v17.78,59.24 26.23,59.24 30.8,54.67 30.8,52.51 | v50.93,47.62 53.47,47.62 54.1,48.26 54.1,49.88 50.65,53.34 31.62,53.34 30.8,52.51 | v29.84,43.34 29.73,43.34 28.78,44.29 28.78,44.77 30.78,46.77 30.78,52.5 30.8,52.51
  Bottom 0.305: 24,40.39 22.86,40.39 12.83,30.35 v10.54,30.35
SCL  (via drill 0.48)
  Top 0.254: R13.5 79.53,27.25 Q4.3 79.99,26.8 v80.39,26.8 | v84.07,28.45 84.18,28.56 I2C.4
  Bottom 0.254: v80.39,26.8 82.42,26.8 v84.07,28.45
SCL_3V  (via drill 0.48)
  Top 0.254: U$2.64 43.37,30.73 44.77,29.34 45.72,29.34 46.48,28.57 v46.48,28.45 | R13.6 78.63,25.13 78.99,24.77 80.52,24.77 81.28,25.53 81.28,28.7 80.76,29.22 v80.52,29.22 Q4.4 | v69.09,16.51 69.09,13.97 69.34,13.72 IC3.6
  Bottom 0.254: v46.48,28.45 46.48,27.94 57.91,16.51 v69.09,16.51 69.34,16.76 72.77,16.76 74.55,18.54 74.55,31.24 75.56,32.26 79.5,32.26 80.52,31.24 v80.52,29.22
SD_CS  (via drill 0.48, 0.5)
  Top 0.254: U$2.59 40.87,29.99 42.29,28.57 v42.29,27.56 | 9.78,27.03 13.31,27.03 15.24,28.96 17.06,28.96 R18.2 19.27,28.49 v20.19,27.56
  Top 0.305: 9.78,27.03 X1.2
  Bottom 0.254: v42.29,27.56 41.02,27.56 40.64,27.94 21.59,27.94 21.21,27.56 v20.19,27.56
SDA
  Top 0.254: R13.8 76.93,28.29 Q4.6 77.72,29.36 77.72,30.61 79.01,31.89 I2C.3
SDA_3V  (via drill 0.48)
  Top 0.254: U$2.63 42.92,31.57 42.92,30.51 44.93,28.5 v45.27,28.5 | Q4.1 77.83,27.39 R13.7 77.83,24.91 77.76,24.84 76.26,24.84 76.09,25.01 v76.09,26.47 | IC3.5 69.34,12.45 68.19,13.6 v68.19,15.42
  Bottom 0.254: v45.27,28.5 58.36,15.42 v68.19,15.42 72.07,15.42 75.01,18.35 75.01,25.39 v76.09,26.47
SPK_SD
  Top 0.203: U$2.51 36.87,31.1 32.95,27.18 28.32,27.18 21.99,20.85 21.99,10.34 R22.2 23.33,7.11 27.52,7.11 28.86,8.45
  Top 0.305: 28.86,8.45 IC2.4
SPKR+  (via drill 0.48)
  Top 0.305: CON1.2 v26.81,12.32 26.81,11.79 IC2.1 | SP1.+ 35.81,7.74 v35.81,9.78
  Bottom 0.305: v35.81,9.78 34.16,8.13 30.48,8.13 26.8,11.81 26.81,11.82 v26.81,12.32
SPRK-
  Top 0.254: IC2.6 29.21,11.24 | IC2.6
  Top 0.305: IC2.6 28.06,12.04 CON1.1 | 29.21,11.24 31.94,11.24 SJ4.1
SWCLK  (via drill 0.5)
  Top 0.254: U$2.57 39.87,29.7 41.05,28.52 41.05,26.79 41.71,26.14 41.71,23.8 41.4,23.5 v41.27,23.5 | X3.4 39.75,15.63 40.39,15 41.66,15 v42.42,15.75 43.81,17.14 TP8.P$1
  Bottom 0.254: v41.27,23.5 41.27,16.89 v42.42,15.75
SWDIO
  Top 0.254: X3.2 41.92,16.77 42.16,17.02 42.16,20.45 | 42.16,20.45 42.16,26.32 41.51,26.98 41.51,28.71 40.37,29.85 U$2.58 | TP7.P$1 42.16,20.45
TFT_BACKLITE
  Top 0.254: U$2.60 41.37,30.14 43.07,28.44 43.07,26.35 42.62,25.89 42.62,23.67 44.07,22.23 46.01,22.23 R2.1 45.72,21.42 45.72,19.05 46.17,18.6 U3.4
TFT_CS  (via drill 0.48)
  Top 0.254: U$2.9 47.77,36.32 49.24,37.78 49.24,38.48 49.9,39.14 X2.38 59.97,39.14 60.45,39.62 v60.45,42.55 | R20.2 61.25,52.07 v60.2,52.07
  Bottom 0.254: v60.2,52.07 60.2,46.36 60.58,45.97 60.58,42.55
  Bottom 0.305: 60.58,42.55 v60.45,42.55
TFT_RD
  Top 0.254: U$2.5 45.68,34.32 46.36,33.64 50.15,33.64 51.8,35.29 51.8,35.78 53.66,37.64 X2.35
TFT_RESET
  Top 0.254: U$2.1 44.07,30.79 44.9,29.97 46.05,29.97 47.26,28.77 47.26,28.44 47.62,28.07 51.05,28.07 52.2,29.21 55.24,29.21 56.39,28.07 56.39,25.57 56.82,25.14 X2.10
TFT_RS
  Top 0.254: 45.83,34.82 46.55,34.09 49.96,34.09 51.22,35.36 51.22,37.66 52.21,38.64 X2.37 | U$2.6 45.83,34.82 | 45.83,34.82
TFT_TE
  Top 0.254: U$2.10 47.63,36.82 48.78,37.97 48.78,38.88 49.55,39.64 X2.39
TFT_WR  (via drill 0.5)
  Top 0.254: v52.32,37.59 52.83,37.59 53.38,38.14 X2.36 60.74,38.14 61.47,38.87 61.47,43.18 57.4,47.24 SJ3.1 | v47.24,38.48 46.58,37.82 U$2.12
  Bottom 0.254: v52.32,37.59 52.2,37.47 47.75,37.47 47.24,37.97 v47.24,38.48
TOUCH_XL  (via drill 0.48)
  Top 0.203: U$2.62 42.37,30.32 45.11,27.58 51.84,27.58 52.51,28.25 v52.51,28.38 | v48.88,41.52 48.88,42.64 48.96,42.73
  Top 0.254: X2.46 49.38,43.14 48.96,42.73
  Bottom 0.203: v52.51,28.38 52.51,28.57 52.52,28.57 55.22,31.27 | 49.38,41.02 50.16,41.02 50.7,41.56 52.1,41.56 55.22,38.44 55.22,31.27 | 55.22,31.27
  Bottom 0.254: v48.88,41.52 49.38,41.02 | 49.38,41.02
TOUCH_XR
  Top 0.254: U$2.11 47.48,37.32 48.32,38.16 48.32,39.15 51.05,41.87 53.27,41.87 53.55,42.14 X2.44
TOUCH_YD  (via drill 0.48)
  Top 0.203: U$2.61 41.87,30.25 44.95,27.18 52.46,27.18 v53.72,28.44 | v49.91,42.03 50.2,42.32 52.96,42.32
  Top 0.254: 52.96,42.32 53.28,42.64 X2.45
  Bottom 0.203: v53.72,28.44 55.63,30.34 55.63,38.61 52.2,42.03 v49.91,42.03
TOUCH_YU
  Top 0.254: U$2.15 44.91,39.32 49.23,43.64 X2.47
TXD  (via drill 0.48)
  Top 0.254: U$2.25 39.37,43.43 37.21,45.59 33.53,45.59 32.26,46.86 30.86,46.86 v29.34,48.39
  Top 0.305: X6.34 12.53,58.75 v12.83,59.05
  Bottom 0.254: v12.83,59.05 12.83,58.98 13.79,58.01 26.11,58.01 29.59,54.53 29.59,48.64 v29.34,48.39
VBUS  (via drill 0.48)
  Top 0.305: v8.51,17.13 8.62,17.13
  Top 0.508: X5.A4B9 v8.51,17.13 | 8.62,17.13 PTC1.2 | X5.B4A9 7.73,12.33 v8.38,11.68
  Bottom 0.508: v8.38,11.68 8.38,17 v8.51,17.13
VCC
  Top 0.254: 76.2,33.91 77.02,33.91 76.96,33.85 SJ1.2 76.96,32.51 | C7.1 78.17,33.98 78.11,33.91 | I2C.2 84.2,33.91 84.58,33.91 | 79.91,20.73 79.5,20.32 | 75.02,23.91 74.93,24
  Top 0.305: NEOPIX.2 86.74,45.72 | 86.61,33.91 84.58,33.91 | SENSE.2 83.44,20.32 | I2C.2 84.17,33.91 83.31,33.91
  Top 0.813: 83.31,33.91 78.11,33.91 77.02,33.91 | 83.44,20.32 79.5,20.32 77.09,20.32 74.93,22.48 74.93,24 74.93,32.64 76.2,33.91 | 86.74,45.72 87.25,45.21 87.25,42.67 86.61,42.04 86.61,37.59 87.5,36.7 87.5,34.8 86.61,33.91 | R13.4 79.91,23.53 79.91,20.73 | R13.1 75.02,23.91
VDDCORE
  Top 0.254: C6.1 35.24,27.62 36.03,28.41 C9.1 C10.2 37.87,28.51 U$2.53